# Altium project blackfin.PrjPCB (part 1 of 2)
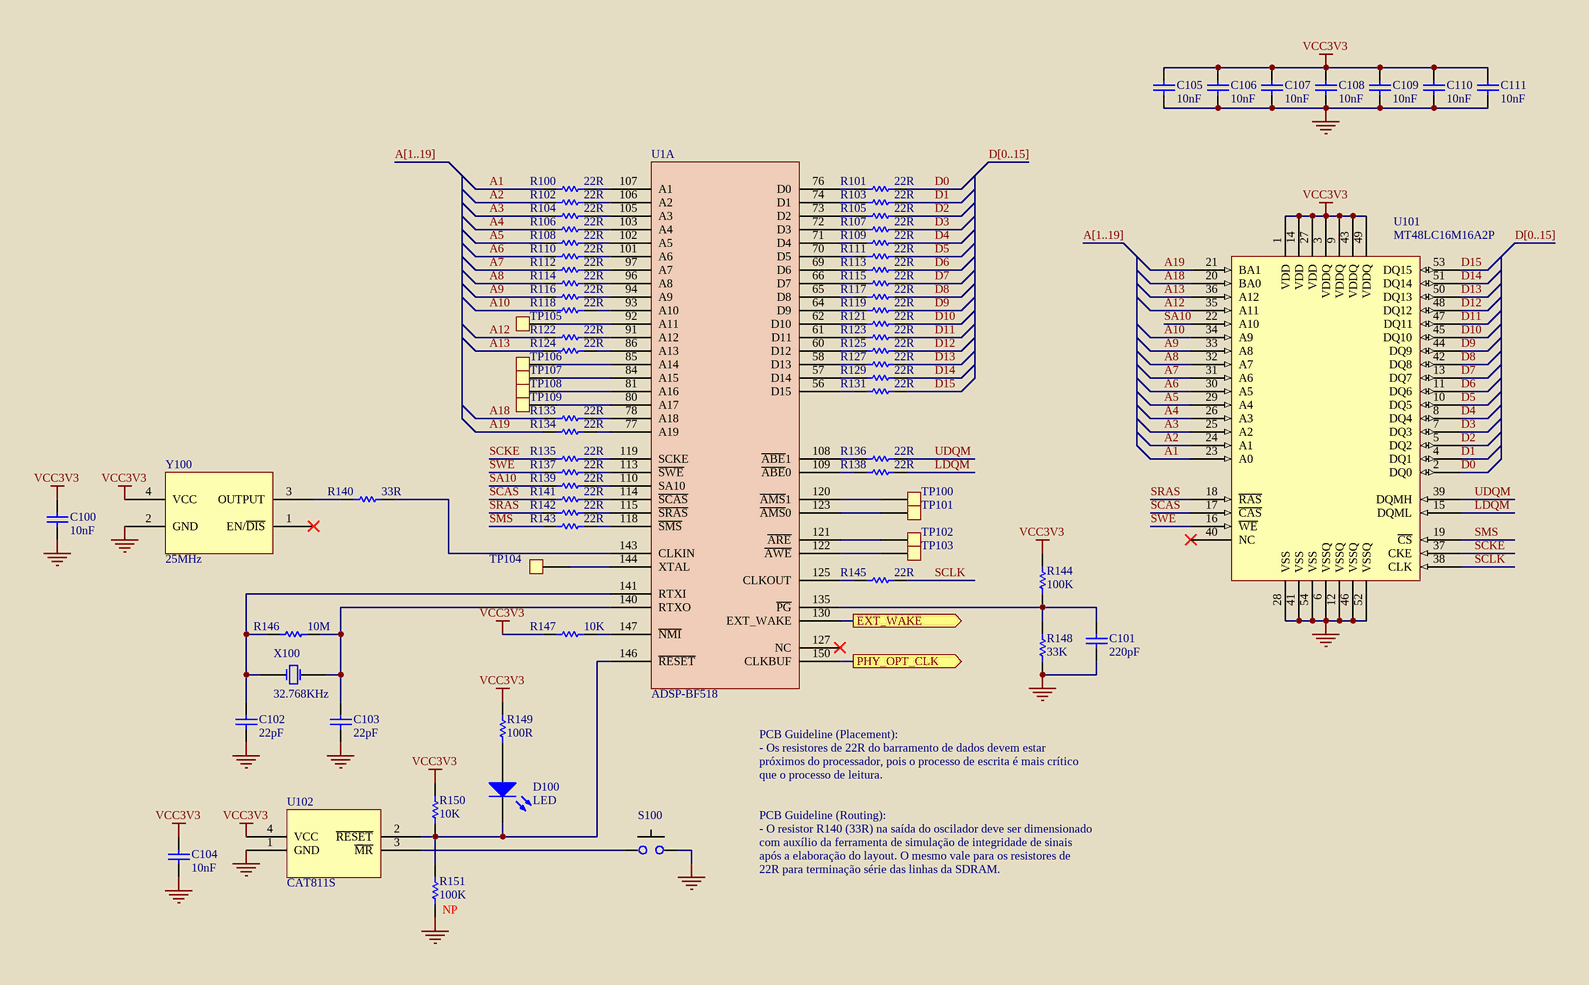
[diagram p0: blackfin_a_sdram.SchDoc]
6 sheets, 408 parts. Net scope: global (net labels, ports and power ports of the same name join across sheets).
Board file: blackfin_pcb.PcbDoc
Sheets:
  blackfin_a_sdram.SchDoc
  blackfin_b_flash_jtag_serial.SchDoc
  blackfin_c_ethernet.SchDoc
  blackfin_d_codec.SchDoc
  blackfin_e_lcd_keypad.SchDoc
  blackfin_f_power.SchDoc

## Sheet blackfin_a_sdram.SchDoc: SDRAM
size A3; SheetNumber: 1; SheetTotal: 6

### Parts
C100  10nF  [C_0603]
C101  220pF  [C_0603]
C102  22pF  [C_0603]
C103  22pF  [C_0603]
C104  10nF  [C_0603]
C105  10nF  [C_0603]
C106  10nF  [C_0603]
C107  10nF  [C_0603]
C108  10nF  [C_0603]
C109  10nF  [C_0603]
C110  10nF  [C_0603]
C111  10nF  [C_0603]
D100  LED  [LED_0603]
R100  22R  [R_0402]
R101  22R  [R_0402]
R102  22R  [R_0402]
R103  22R  [R_0402]
R104  22R  [R_0402]
R105  22R  [R_0402]
R106  22R  [R_0402]
R107  22R  [R_0402]
R108  22R  [R_0402]
R109  22R  [R_0402]
R110  22R  [R_0402]
R111  22R  [R_0402]
R112  22R  [R_0402]
R113  22R  [R_0402]
R114  22R  [R_0402]
R115  22R  [R_0402]
R116  22R  [R_0402]
R117  22R  [R_0402]
R118  22R  [R_0402]
R119  22R  [R_0402]
R121  22R  [R_0402]
R122  22R  [R_0402]
R123  22R  [R_0402]
R124  22R  [R_0402]
R125  22R  [R_0402]
R127  22R  [R_0402]
R129  22R  [R_0402]
R131  22R  [R_0402]
R133  22R  [R_0402]
R134  22R  [R_0402]
R135  22R  [R_0402]
R136  22R  [R_0402]
R137  22R  [R_0402]
R138  22R  [R_0402]
R139  22R  [R_0402]
R140  33R  [R_0402]
R141  22R  [R_0402]
R142  22R  [R_0402]
R143  22R  [R_0402]
R144  100K  [R_0603]
R145  22R  [R_0402]
R146  10M  [R_0603]
R147  10K  [R_0603]
R148  33K  [R_0603]
R149  100R  [R_0603]
R150  10K  [R_0603]
R151  100K  [R_0603]
S100  Push Button  [Push Button]  (value not drawn)
TP100  Test Point  [Test Point]  (value not drawn)  (no BOM)
TP101  Test Point  [Test Point]  (value not drawn)  (no BOM)
TP102  Test Point  [Test Point]  (value not drawn)  (no BOM)
TP103  Test Point  [Test Point]  (value not drawn)  (no BOM)
TP104  Test Point  [Test Point]  (value not drawn)  (no BOM)
TP105  Test Point  [Test Point]  (value not drawn)  (no BOM)
TP106  Test Point  [Test Point]  (value not drawn)  (no BOM)
TP107  Test Point  [Test Point]  (value not drawn)  (no BOM)
TP108  Test Point  [Test Point]  (value not drawn)  (no BOM)
TP109  Test Point  [Test Point]  (value not drawn)  (no BOM)
U1  ADSP-BF518  [LQFP-176]  (part A of 4)
U101  MT48LC16M16A2P  [TSOP-54]
U102  CAT811S  [SOT-143]
X100  32.768KHz  [XTAL_32.768kHz]
Y100  25MHz  [OSC_25MHz]

### Ports
EXT_WAKE (out), PHY_OPT_CLK (out)

### Nets
GND: C100.1 C101.1 C102.1 C103.1 C104.1 C105.1 C106.1 C107.1 C108.1 C109.1 C110.1 C111.1 R148.1 R151.1 S100.2 U101.6(VSSQ) U101.12(VSSQ) U101.28(VSS) U101.41(VSS) U101.46(VSSQ) U101.52(VSSQ) U101.54(VSS) U102.1(GND) Y100.2(GND)
VCC3V3: C100.2 C104.2 C105.2 C106.2 C107.2 C108.2 C109.2 C110.2 C111.2 R144.2 R147.2 R149.2 R150.1 U101.1(VDD) U101.3(VDDQ) U101.9(VDDQ) U101.14(VDD) U101.27(VDD) U101.43(VDDQ) U101.49(VDDQ) U102.4(VCC) Y100.4(VCC)
A1: R100.1 U101.23(A0)
A2: R102.1 U101.24(A1)
A3: R104.1 U101.25(A2)
A4: R106.1 U101.26(A3)
A5: R108.1 U101.29(A4)
A6: R110.1 U101.30(A5)
A7: R112.1 U101.31(A6)
A8: R114.1 U101.32(A7)
A9: R116.1 U101.33(A8)
A10: R118.1 U101.34(A9)
A12: R122.1 U101.35(A11)
A13: R124.1 U101.36(A12)
A18: R133.1 U101.20(BA0)
A19: R134.1 U101.21(BA1)
D0: R101.2 U101.2(DQ0)
D1: R103.2 U101.4(DQ1)
D2: R105.2 U101.5(DQ2)
D3: R107.2 U101.7(DQ3)
D4: R109.2 U101.8(DQ4)
D5: R111.2 U101.10(DQ5)
D6: R113.2 U101.11(DQ6)
D7: R115.2 U101.13(DQ7)
D8: R117.2 U101.42(DQ8)
D9: R119.2 U101.44(DQ9)
D10: R121.2 U101.45(DQ10)
D11: R123.2 U101.47(DQ11)
D12: R125.2 U101.48(DQ12)
D13: R127.2 U101.50(DQ13)
D14: R129.2 U101.51(DQ14)
D15: R131.2 U101.53(DQ15)
EXT_WAKE: U1.130(EXT_WAKE) ; port EXT_WAKE
LDQM: R138.2 U101.15(DQML)
PHY_OPT_CLK: U1.150(CLKBUF) ; port PHY_OPT_CLK
SA10: R139.1 U101.22(A10)
SCAS: R141.1 U101.17(~{CAS})
SCKE: R135.1 U101.37(CKE)
SCLK: R145.2 U101.38(CLK)
SMS: R143.1 U101.19(~{CS})
SRAS: R142.1 U101.18(~{RAS})
SWE: R137.1 U101.16(~{WE})
UDQM: R136.2 U101.39(DQMH)
NetC101_2: C101.2 R144.1 R148.2 U1.135(~{PG})
NetC102_2: C102.2 R146.1 U1.141(RTXI) X100.1(OSC1)
NetC103_2: C103.2 R146.2 U1.140(RTXO) X100.2(OSC2)
NetD100_1: D100.1(A) R149.1
NetD100_2: D100.2(K) R150.2 R151.2 U1.146(~{RESET}) U102.2(~{RESET})
NetR100_2: R100.2 U1.107(A1)
NetR101_1: R101.1 U1.76(D0)
NetR102_2: R102.2 U1.106(A2)
NetR103_1: R103.1 U1.74(D1)
NetR104_2: R104.2 U1.105(A3)
NetR105_1: R105.1 U1.73(D2)
NetR106_2: R106.2 U1.103(A4)
NetR107_1: R107.1 U1.72(D3)
NetR108_2: R108.2 U1.102(A5)
NetR109_1: R109.1 U1.71(D4)
NetR110_2: R110.2 U1.101(A6)
NetR111_1: R111.1 U1.70(D5)
NetR112_2: R112.2 U1.97(A7)
NetR113_1: R113.1 U1.69(D6)
NetR114_2: R114.2 U1.96(A8)
NetR115_1: R115.1 U1.66(D7)
NetR116_2: R116.2 U1.94(A9)
NetR117_1: R117.1 U1.65(D8)
NetR118_2: R118.2 U1.93(A10)
NetR119_1: R119.1 U1.64(D9)
NetR121_1: R121.1 U1.62(D10)
NetR122_2: R122.2 U1.91(A12)
NetR123_1: R123.1 U1.61(D11)
NetR124_2: R124.2 U1.86(A13)
NetR125_1: R125.1 U1.60(D12)
NetR127_1: R127.1 U1.58(D13)
NetR129_1: R129.1 U1.57(D14)
NetR131_1: R131.1 U1.56(D15)
NetR133_2: R133.2 U1.78(A18)
NetR134_2: R134.2 U1.77(A19)
NetR135_2: R135.2 U1.119(SCKE)
NetR136_1: R136.1 U1.108(~{ABE}1)
NetR137_2: R137.2 U1.113(~{SWE})
NetR138_1: R138.1 U1.109(~{ABE}0)
NetR139_2: R139.2 U1.110(SA10)
NetR140_1: R140.1 Y100.3(OUTPUT)
NetR140_2: R140.2 U1.143(CLKIN)
NetR141_2: R141.2 U1.114(~{SCAS})
NetR142_2: R142.2 U1.115(~{SRAS})
NetR143_2: R143.2 U1.118(~{SMS})
NetR145_1: R145.1 U1.125(CLKOUT)
NetR147_1: R147.1 U1.147(~{NMI})
NetS100_1: S100.1 U102.3(~{MR})
NetTP100_1: TP100.1 U1.120(~{AMS}1)
NetTP101_1: TP101.1 U1.123(~{AMS}0)
NetTP102_1: TP102.1 U1.121(~{ARE})
NetTP103_1: TP103.1 U1.122(~{AWE})
NetTP104_1: TP104.1 U1.144(XTAL)
NetTP105_1: TP105.1 U1.92(A11)
NetTP106_1: TP106.1 U1.85(A14)
NetTP107_1: TP107.1 U1.84(A15)
NetTP108_1: TP108.1 U1.81(A16)
NetTP109_1: TP109.1 U1.80(A17)

Not connected (* = marked no-connect by the designer): U1 127(NC)*; U101 40(NC)*; Y100 1(EN/~{DIS})*

### Buses and harness runs
bus A[1..19]
bus D[0..15]

### Notes on the sheet
- PCB Guideline (Placement):
- - Os resistores de 22R do barramento de dados devem estar
- próximos do processador, pois o processo de escrita é mais crítico
- que o processo de leitura.
- PCB Guideline (Routing):
- - O resistor R140 (33R) na saída do oscilador deve ser dimensionado
- com auxílio da ferramenta de simulação de integridade de sinais
- após a elaboração do layout. O mesmo vale para os resistores de
- 22R para terminação série das linhas da SDRAM.
- (near R151) NP
- Título:
- Universidade Federal do Ceará
- Padrão:
- Autor:
- A3
- Rômulo Mendes
- Data:
- Versão:
- Folha:
- V1
- de
- Centro de Tecnologia
- Dep. de Eng. Elétrica
- Dep. de Eng. de Teleinformática
- Arquivo:
- Fortaleza - Ceará - Brasil

### Library data of the parts
C100 C104-C111 = Capacitor: eVendorPart#: 77-VJ0603Y103KXAPBC; Manufacturer: Vishay/Vitramon; Part#: VJ0603Y103KXAPW1BC; eVendor: Mouser; eVendorPrice: 0,05; MSRP: 0,013; MOQ: 1000
C101 = Capacitor: eVendorPart#: 81-GRM18R72A221KA01D; Manufacturer: Murata; Part#: GRM188R72A221KA01D; eVendor: Mouser; eVendorPrice: 0,05; MSRP: 0,012; MOQ: 1000
C102 C103 = Capacitor: eVendorPart#: 581-06035A220J; Manufacturer: AVX; Part#: 06035A220JAT2A; eVendor: Mouser; eVendorPrice: 0,03; MSRP: 0,018; MOQ: 1000
D100 = LED: Red LED; eVendorPart#: 638-QTLP600C2TR; Manufacturer: Everlight; Part#: QTLP600C2TR; eVendor: Mouser; eVendorPrice: 0,22; MSRP: 0,083; MOQ: 1000
R100-R119 R121-R125 R127 R129 R131 R133-R139 R141-R143 R145 = Resistor: eVendorPart#: 71-CRCW0402J-22-E3; Part#: CRCW040222R0JNED; Manufacturer: Vishay/Dale; eVendor: Mouser; eVendorPrice: 0,06; MSRP: 0,01; MOQ: 1000
R140 = Resistor: eVendorPart#: 71-CRCW0402J-33-E3; Part#: CRCW040233R0JNED; Manufacturer: Vishay/Dale; eVendor: Mouser; eVendorPrice: 0,06; MSRP: 0,01; MOQ: 1000
R144 R151 = Resistor: eVendorPart#: 71-CRCW0603J-100K-E3; Part#: CRCW0603100KJNEA; Manufacturer: Vishay/Dale; eVendor: Mouser; eVendorPrice: 0,06; MSRP: 0,01; MOQ: 1000
R146 = Resistor: eVendorPart#: 652-CR0603FX-1005ELF; Part#: CR0603-FX-1005ELF; Manufacturer: Bourns; eVendor: Mouser; eVendorPrice: 0,05; MSRP: 0,004; MOQ: 1000
R147 R150 = Resistor: eVendorPart#: 71-CRCW0603-10K-E3; Part#: CRCW060310K0FKEA; Manufacturer: Vishay/Dale; eVendor: Mouser; eVendorPrice: 0,06; MSRP: 0,015; MOQ: 1000
R148 = Resistor: eVendorPart#: 71-CRCW0603J-33K-E3; Part#: CRCW060333K0JNEA; Manufacturer: Vishay/Dale; eVendor: Mouser; eVendorPrice: 0,06; MSRP: 0,01; MOQ: 1000
R149 = Resistor: eVendorPart#: 71-CRCW0603-100-E3; Part#: CRCW0603100RFKEA; Manufacturer: Vishay/Dale; eVendor: Mouser; eVendorPrice: 0,06; MSRP: 0,015; MOQ: 1000
S100 = Push Button: eVendorPart#: 611-PTS645SH50SMTRLF; Part#: PTS645SH50SMTRLFS; Manufacturer: C&K Components; eVendor: Mouser; MSRP: 0,135; eVendorPrice: 0,27; MOQ: 1000
TP100-TP109 = Test Point: eVendor: NÃO SE APLICA; eVendorPrice: 0,00; eVendorPart#: NÃO SE APLICA; Part#: NÃO SE APLICA; Manufacturer: NÃO SE APLICA; MOQ: 1000; MSRP: 0,00
U1 = ADSP-BF518: eVendorPart#: ADSP-BF518BSWZ-4; eVendor: Analog Devices; eVendorPrice: 13,76; MSRP: 13,07; Part#: ADSP-BF518BSWZ-4; Manufacturer: Analog Devices; MOQ: 1000
U101 = MT48LC16M16A2P: Part#: MT48LC16M16A2P-75:D TR; eVendorPart#: 557-1059-1-ND; Manufacturer: Micron; eVendor: Digikey; eVendorPrice: 10,73; MSRP: 6,6825; MOQ: 1000
U102 = CAT811S: Part#: CAT811STBI-GT3; Manufacturer: ON Semiconductor; eVendorPart#: 698-CAT811STBI-GT3; eVendor: Mouser; eVendorPrice: 0,22; MSRP: 0,156; MOQ: 1000
X100 = XTAL: eVendorPart#: SER2405CT-ND; Part#: MC-405; Manufacturer: Epson; eVendor: Digikey; eVendorPrice: 0,95; MSRP: 0,54; MOQ: 1000
Y100 = Oscillator_25MHz: eVendorPart#: 815-ASV-25-EJ-T; Part#: ASV-25.000MHZ-EJ-T; Manufacturer: ABRACON; eVendor: Mouser; eVendorPrice: 2,89; MSRP: 1,12; MOQ: 1000

## Sheet blackfin_b_flash_jtag_serial.SchDoc: Flash, JTAG, RS-232
size A3; SheetNumber: 2; SheetTotal: 6
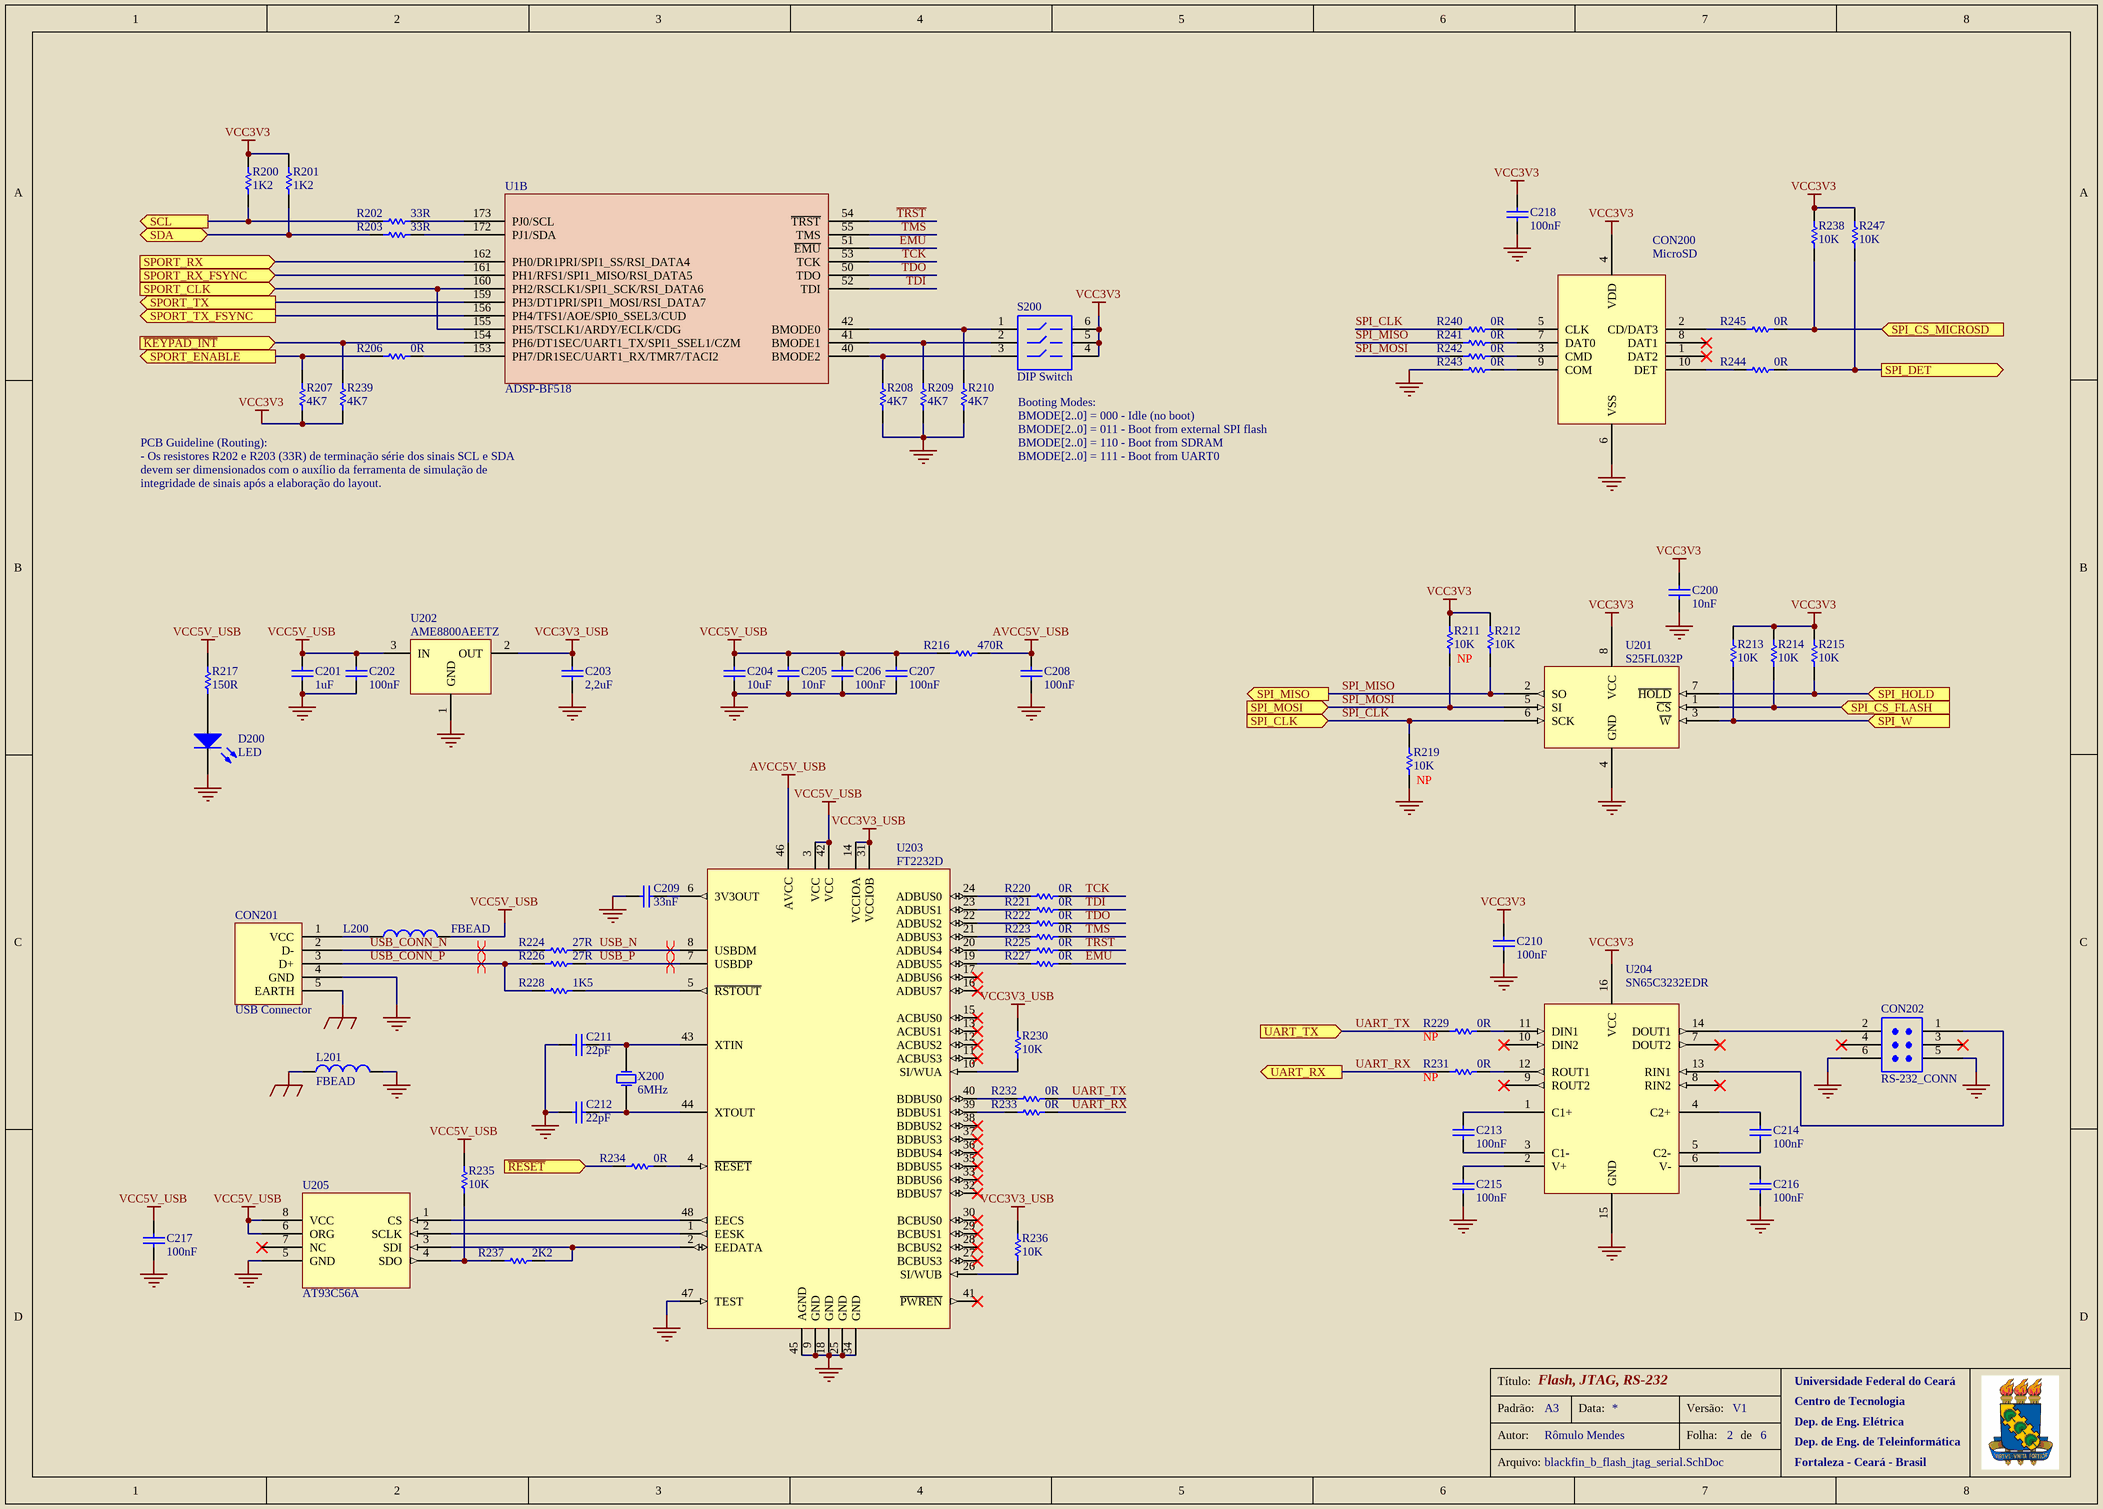
[diagram p1: blackfin_b_flash_jtag_serial.SchDoc]

### Parts
C200  10nF  [C_0603]
C201  1uF  [C_0603]
C202  100nF  [C_0603]
C203  2,2uF  [C_0603]
C204  10uF  [C_0805]
C205  10nF  [C_0603]
C206  100nF  [C_0603]
C207  100nF  [C_0603]
C208  100nF  [C_0603]
C209  33nF  [C_0603]
C210  100nF  [C_0603]
C211  22pF  [C_0603]
C212  22pF  [C_0603]
C213  100nF  [C_0603]
C214  100nF  [C_0603]
C215  100nF  [C_0603]
C216  100nF  [C_0603]
C217  100nF  [C_0603]
C218  100nF  [C_0603]
CON200  MicroSD  [MICRO_SD]
CON201  USB Connector  [USB Connector]
CON202  RS-232_CONN  [Header_2x3]
D200  LED  [LED_0603]
L200  FBEAD  [L_0603]
L201  FBEAD  [L_0603]
R200  1K2  [R_0603]
R201  1K2  [R_0603]
R202  33R  [R_0402]
R203  33R  [R_0402]
R206  0R  [R_0603]
R207  4K7  [R_0603]
R208  4K7  [R_0603]
R209  4K7  [R_0603]
R210  4K7  [R_0603]
R211  10K  [R_0603]
R212  10K  [R_0603]
R213  10K  [R_0603]
R214  10K  [R_0603]
R215  10K  [R_0603]
R216  470R  [R_0603]
R217  150R  [R_0603]
R219  10K  [R_0603]
R220  0R  [R_0603]
R221  0R  [R_0603]
R222  0R  [R_0603]
R223  0R  [R_0603]
R224  27R  [R_0603]
R225  0R  [R_0603]
R226  27R  [R_0603]
R227  0R  [R_0603]
R228  1K5  [R_0603]
R229  0R  [R_0603]
R230  10K  [R_0603]
R231  0R  [R_0603]
R232  0R  [R_0603]
R233  0R  [R_0603]
R234  0R  [R_0603]
R235  10K  [R_0603]
R236  10K  [R_0603]
R237  2K2  [R_0603]
R238  10K  [R_0603]
R239  4K7  [R_0603]
R240  0R  [R_0603]
R241  0R  [R_0603]
R242  0R  [R_0603]
R243  0R  [R_0603]
R244  0R  [R_0603]
R245  0R  [R_0603]
R247  10K  [R_0603]
S200  DIP Switch  [DIP Switch]
U1  ADSP-BF518  [LQFP-176]  (part B of 4)
U201  S25FL032P  [SO-8]
U202  AME8800AEETZ  [SOT-23]
U203  FT2232D  [LQFP-48]
U204  SN65C3232EDR  [SOIC-16]
U205  AT93C56A  [SOIC-8 (AT93C56A)]
X200  6MHz  [XTAL_6MHz]

### Ports
SCL (out), SDA (bidir), SPI_CLK (in), SPI_CS_FLASH (in), SPI_CS_MICROSD (in), SPI_DET (out), SPI_HOLD (in), SPI_MISO (out), SPI_MOSI (in), SPI_W (in), SPORT_CLK (in), SPORT_ENABLE (out), SPORT_RX (in), SPORT_RX_FSYNC (in), SPORT_TX (out), SPORT_TX_FSYNC (out), UART_RX (out), UART_TX (in), ~{KEYPAD_INT} (in), ~{RESET} (in)

### Nets
AVCC5V_USB: C208.2 R216.2 U203.46(AVCC)
EARTH_USB: CON201.5(EARTH) L201.1
GND: C200.1 C201.1 C202.1 C203.1 C204.1 C205.1 C206.1 C207.1 C208.1 C209.2 C210.1 C211.2 C212.2 C215.1 C216.1 C217.1 C218.1 CON200.6(VSS) CON201.4(GND) CON202.5(GND) CON202.6(GND) D200.2(K) L201.2 R208.1 R209.1 R210.1 R219.1 R243.1 U201.4(GND) U202.1(GND) U203.9(GND) U203.18(GND) U203.25(GND) U203.34(GND) U203.45(AGND) U203.47(TEST) U204.15(GND) U205.5(GND)
VCC3V3: C200.2 C210.2 C218.2 CON200.4(VDD) R200.2 R201.2 R207.1 R211.2 R212.2 R213.2 R214.2 R215.2 R238.2 R239.1 R247.2 S200.4 S200.5 S200.6 U201.8(VCC) U204.16(VCC)
VCC3V3_USB: C203.2 R230.1 R236.1 U202.2(OUT) U203.14(VCCIOA) U203.31(VCCIOB)
VCC5V_USB: C201.2 C202.2 C204.2 C205.2 C206.2 C207.2 C217.2 L200.2 R216.1 R217.2 R235.2 U202.3(IN) U203.3(VCC) U203.42(VCC) U205.6(ORG) U205.8(VCC)
~{EMU}: R227.2 U1.51(~{EMU})
~{KEYPAD_INT}: R239.2 U1.154(PH6/DT1SEC/UART1_TX/SPI1_SSEL1/CZM) ; port ~{KEYPAD_INT}
~{RESET}: R234.1 ; port ~{RESET}
SCL: R200.1 R202.1 ; port SCL
SDA: R201.1 R203.1 ; port SDA
SPI_CLK: R219.2 R240.1 U201.6(SCK) ; port SPI_CLK
SPI_CS_FLASH: R214.1 U201.1(~{CS}) ; port SPI_CS_FLASH
SPI_CS_MICROSD: R238.1 R245.2 ; port SPI_CS_MICROSD
SPI_DET: R244.2 R247.1 ; port SPI_DET
SPI_HOLD: R215.1 U201.7(~{HOLD}) ; port SPI_HOLD
SPI_MISO: R212.1 R241.1 U201.2(SO) ; port SPI_MISO
SPI_MOSI: R211.1 R242.1 U201.5(SI) ; port SPI_MOSI
SPI_W: R213.1 U201.3(~{W}) ; port SPI_W
SPORT_CLK: U1.155(PH5/TSCLK1/ARDY/ECLK/CDG) U1.160(PH2/RSCLK1/SPI1_SCK/RSI_DATA6) ; port SPORT_CLK
SPORT_ENABLE: R206.1 R207.2 ; port SPORT_ENABLE
SPORT_RX: U1.162(PH0/DR1PRI/SPI1_SS/RSI_DATA4) ; port SPORT_RX
SPORT_RX_FSYNC: U1.161(PH1/RFS1/SPI1_MISO/RSI_DATA5) ; port SPORT_RX_FSYNC
SPORT_TX: U1.159(PH3/DT1PRI/SPI1_MOSI/RSI_DATA7) ; port SPORT_TX
SPORT_TX_FSYNC: U1.156(PH4/TFS1/AOE/SPI0_SSEL3/CUD) ; port SPORT_TX_FSYNC
~{TRST}: R225.2 U1.54(~{TRST})
TCK: R220.2 U1.53(TCK)
TDI: R221.2 U1.52(TDI)
TDO: R222.2 U1.50(TDO)
TMS: R223.2 U1.55(TMS)
UART_RX: R231.1 R233.2 ; port UART_RX
UART_TX: R229.1 R232.2 ; port UART_TX
USB_CONN_N: CON201.2(D-) R224.1
USB_CONN_P: CON201.3(D+) R226.1 R228.1
USB_N: R224.2 U203.8(USBDM)
USB_P: R226.2 U203.7(USBDP)
NetC209_1: C209.1 U203.6(3V3OUT)
NetC211_1: C211.1 U203.43(XTIN) X200.2(OSC2)
NetC212_1: C212.1 U203.44(XTOUT) X200.1(OSC1)
NetC213_1: C213.1 U204.3(C1-)
NetC213_2: C213.2 U204.1(C1+)
NetC214_1: C214.1 U204.5(C2-)
NetC214_2: C214.2 U204.4(C2+)
NetC215_2: C215.2 U204.2(V+)
NetC216_2: C216.2 U204.6(V-)
NetCON200_2: CON200.2(CD/DAT3) R245.1
NetCON200_3: CON200.3(CMD) R242.2
NetCON200_5: CON200.5(CLK) R240.2
NetCON200_7: CON200.7(DAT0) R241.2
NetCON200_9: CON200.9(COM) R243.2
NetCON200_10: CON200.10(DET) R244.1
NetCON201_1: CON201.1(VCC) L200.1
NetCON202_1: CON202.1(TX) U204.13(RIN1)
NetCON202_2: CON202.2(RX) U204.14(DOUT1)
NetD200_1: D200.1(A) R217.1
NetR202_2: R202.2 U1.173(PJ0/SCL)
NetR203_2: R203.2 U1.172(PJ1/SDA)
NetR206_2: R206.2 U1.153(PH7/DR1SEC/UART1_RX/TMR7/TACI2)
NetR208_2: R208.2 S200.3 U1.40(BMODE2)
NetR209_2: R209.2 S200.2 U1.41(BMODE1)
NetR210_2: R210.2 S200.1 U1.42(BMODE0)
NetR220_1: R220.1 U203.24(ADBUS0)
NetR221_1: R221.1 U203.23(ADBUS1)
NetR222_1: R222.1 U203.22(ADBUS2)
NetR223_1: R223.1 U203.21(ADBUS3)
NetR225_1: R225.1 U203.20(ADBUS4)
NetR227_1: R227.1 U203.19(ADBUS5)
NetR228_2: R228.2 U203.5(~{RSTOUT})
NetR229_2: R229.2 U204.11(DIN1)
NetR230_2: R230.2 U203.10(SI/WUA)
NetR231_2: R231.2 U204.12(ROUT1)
NetR232_1: R232.1 U203.40(BDBUS0)
NetR233_1: R233.1 U203.39(BDBUS1)
NetR234_2: R234.2 U203.4(~{RESET})
NetR235_1: R235.1 R237.2 U205.4(SDO)
NetR236_2: R236.2 U203.26(SI/WUB)
NetR237_1: R237.1 U203.2(EEDATA) U205.3(SDI)
NetU203_1: U203.1(EESK) U205.2(SCLK)
NetU203_48: U203.48(EECS) U205.1(CS)

Not connected (* = marked no-connect by the designer): CON200 1(DAT2)* 8(DAT1)*; CON202 3(NC)* 4(NC)*; U203 11(ACBUS3)* 12(ACBUS2)* 13(ACBUS1)* 15(ACBUS0)* 16(ADBUS7)* 17(ADBUS6)* 27(BCBUS3)* 28(BCBUS2)* 29(BCBUS1)* 30(BCBUS0)* 32(BDBUS7)* 33(BDBUS6)* 35(BDBUS5)* 36(BDBUS4)* 37(BDBUS3)* 38(BDBUS2)* 41(~{PWREN})*; U204 7(DOUT2)* 8(RIN2)* 9(ROUT2)* 10(DIN2)*; U205 7(NC)*

### Layout directives
differential pair: USB_CONN_N, USB_CONN_P, USB_N, USB_P

### Notes on the sheet
- (near R207) PCB Guideline (Routing):
- Booting Modes:
- BMODE[2..0] = 000 - Idle (no boot)
- BMODE[2..0] = 011 - Boot from external SPI flash
- BMODE[2..0] = 110 - Boot from SDRAM
- - Os resistores R202 e R203 (33R) de terminação série dos sinais SCL e SDA
- devem ser dimensionados com o auxílio da ferramenta de simulação de
- integridade de sinais após a elaboração do layout.
- BMODE[2..0] = 111 - Boot from UART0
- (near R211) NP
- (near R219) NP
- (near R229) NP
- (near R231) NP
- Título:
- Universidade Federal do Ceará
- Padrão:
- Autor:
- A3
- Rômulo Mendes
- Data:
- Versão:
- Folha:
- V1
- de
- Centro de Tecnologia
- Dep. de Eng. Elétrica
- Dep. de Eng. de Teleinformática
- Arquivo:
- Fortaleza - Ceará - Brasil

### Library data of the parts
C200 C205 = Capacitor: as C100 on sheet blackfin_a_sdram; MOQ: 1000
C201 = Capacitor: eVendorPart#: 81-GRM188F51E105ZA12; Manufacturer: Murata; Part#: GRM188F51E105ZA12D; eVendor: Mouser; eVendorPrice: 0,07; MSRP: 0,016; MOQ: 1000
C202 C206-C208 C210 C213-C218 = Capacitor: eVendorPart#: 81-GRM188R71E104KA01; Manufacturer: Murata; Part#: GRM188R71E104KA01J; eVendor: Mouser; eVendorPrice: 0,14; MSRP: 0,11; MOQ: 1000
C203 = Capacitor: eVendorPart#: 81-GRM188F51A225ZE01; Manufacturer: Murata; Part#: GRM188F51A225ZE01D; eVendor: Mouser; eVendorPrice: 0,11; MSRP: 0,024; MOQ: 1000
C204 = Capacitor: eVendorPart#: 810-C2012Y5V1C106Z; Manufacturer: TDK; Part#: C2012Y5V1C106Z; eVendor: Mouser; eVendorPrice: 0,10; MSRP: 0,05; MOQ: 1000
C209 = Capacitor: eVendorPart#: 81-GRM18B11E333KA01D; Manufacturer: Murata; Part#: GRM188B11E333KA01D; eVendor: Mouser; eVendorPrice: 0,07; MSRP: 0,013; MOQ: 1000
C211 C212 = Capacitor: as C102 on sheet blackfin_a_sdram; MOQ: 1000
CON200 = MicroSD: Manufacturer: AVX Corporation; Part#: 045138008010890+; eVendorPart#: 478-4965-1-ND; MSRP: 2,394; eVendorPrice: 3,86; eVendor: Digikey; MOQ: 1000
CON201 = USB Connector: eVendorPart#: 649-61729-0010BLF; Manufacturer: FCI; Part#: 61729-0010BLF; eVendor: Mouser; eVendorPrice: 0,58; MSRP: 0,39; MOQ: 1000
CON202 = RS-232 Connector: Part#: 87759-0614; eVendorPart#: 538-87759-0614; Manufacturer: Molex; eVendor: Mouser; eVendorPrice: 0,62; MSRP: 0,48; MOQ: 1000
D200 = LED: as D100 on sheet blackfin_a_sdram; MOQ: 1000
L200 L201 = Inductor: eVendorPart#: 875-MI0603L301R-10; Manufacturer: Laird Technologies; Part#: MI0603L301R-10; eVendor: Mouser; eVendorPrice: 0,16; MSRP: 0,066; MOQ: 1000
R200 R201 = Resistor: eVendorPart#: 71-CRCW0603-1.2K-E3; Part#: CRCW06031K20FKEA; Manufacturer: Vishay/Dale; eVendor: Mouser; eVendorPrice: 0,06; MSRP: 0,015; MOQ: 1000
R202 R203 = Resistor: as R140 on sheet blackfin_a_sdram; MOQ: 1000
R206 R220-R223 R225 R227 R229 R231-R234 R240-R245 = Resistor: eVendorPart#: 71-CRCW06030000Z0EB; Part#: CRCW06030000Z0EB; Manufacturer: Vishay/Dale; eVendor: Mouser; eVendorPrice: 0,06; MSRP: 0,015; MOQ: 1000
R207-R210 R239 = Resistor: eVendorPart#: 71-CRCW0603J-4.7K-E3; Part#: CRCW06034K70JNEA; Manufacturer: Vishay/Dale; eVendor: Mouser; eVendorPrice: 0,06; MSRP: 0,01; MOQ: 1000
R211-R215 R219 R230 R235 R236 R238 R247 = Resistor: as R147 on sheet blackfin_a_sdram; MOQ: 1000
R216 = Resistor: eVendorPart#: 71-CRCW0603-470-E3; Part#: CRCW0603470RFKEA; Manufacturer: Vishay/Dale; eVendor: Mouser; eVendorPrice: 0,06; MSRP: 0,015; MOQ: 1000
R217 = Resistor: eVendorPart#: 71-CRCW0603150RJNEB; Part#: CRCW0603150RJNEB; Manufacturer: Vishay/Dale; eVendor: Mouser; eVendorPrice: 0,06; MSRP: 0,01; MOQ: 1000
R224 R226 = Resistor: eVendorPart#: 71-CRCW0603-27-E3; Part#: CRCW060327R0FKEA; Manufacturer: Vishay/Dale; eVendor: Mouser; eVendorPrice: 0,06; MSRP: 0,015; MOQ: 1000
R228 = Resistor: eVendorPart#: 71-CRCW0603-1.5K-E3; Part#: CRCW06031K50FKEA; Manufacturer: Vishay/Dale; eVendor: Mouser; eVendorPrice: 0,06; MSRP: 0,015; MOQ: 1000
R237 = Resistor: eVendorPart#: 71-CRCW06032K20JNEB; Part#: CRCW06032K20JNEB; Manufacturer: Vishay/Dale; eVendor: Mouser; eVendorPrice: 0,06; MSRP: 0,01; MOQ: 1000
S200 = DIP Switch: eVendorPart#: 611-SDA03H1SBD; Manufacturer: C&K Components; Part#: SDA03H1SBD; eVendor: Mouser; eVendorPrice: 1,21; MSRP: 0,73; MOQ: 1000
U1 = ADSP-BF518: as U1 on sheet blackfin_a_sdram; Part#: ADSP-BF518BSWZ-4; Manufacturer: Analog Devices; MOQ: 1000
U201 = S25FL032P: Part#: S25FL032P0XMFI010; Manufacturer: Spansion; eVendor: Avnet; eVendorPrice: 1,63; MSRP: 1,61; eVendorPart#: S25FL032P0XMFI010; MOQ: 1000
U202 = AME8800AEETZ: eVendorPart#: 827-AME8800AEETZ; Manufacturer: AME; eVendor: Mouser; eVendorPrice: 0,67; MSRP: 0,171; MOQ: 1000; Part#: AME8800AEETZ
U203 = FT2232D: eVendorPart#: 895-FT2232D; Manufacturer: FTDI; eVendor: Mouser; MSRP: 3,80; eVendorPrice: 6,99; Part#: FT2232D; MOQ: 1000
U204 = RS-232 Transceiver: eVendorPart#: 595-SN65C3232EDR; Manufacturer: Texas Instruments; eVendor: Mouser; MSRP: 0,932; eVendorPrice: 1,41; Part#: SN65C3232EDR; MOQ: 1000
U205 = AT93C56A: eVendorPart#: 556-A93C56A10SU2.7; Manufacturer: Atmel; Part#: AT93C56A-10SU-2.7; eVendor: Mouser; eVendorPrice: 0,42; MSRP: 0,24; MOQ: 1000
X200 = XTAL: eVendorPart#: 774-ATS060SM-1; Part#: ATS060SM-1; Manufacturer: CTS Electronic Components; eVendor: Mouser; eVendorPrice: 0,49; MSRP: 0,23; MOQ: 1000

## Sheet blackfin_c_ethernet.SchDoc: Ethernet
size A3; SheetNumber: 3; SheetTotal: 6
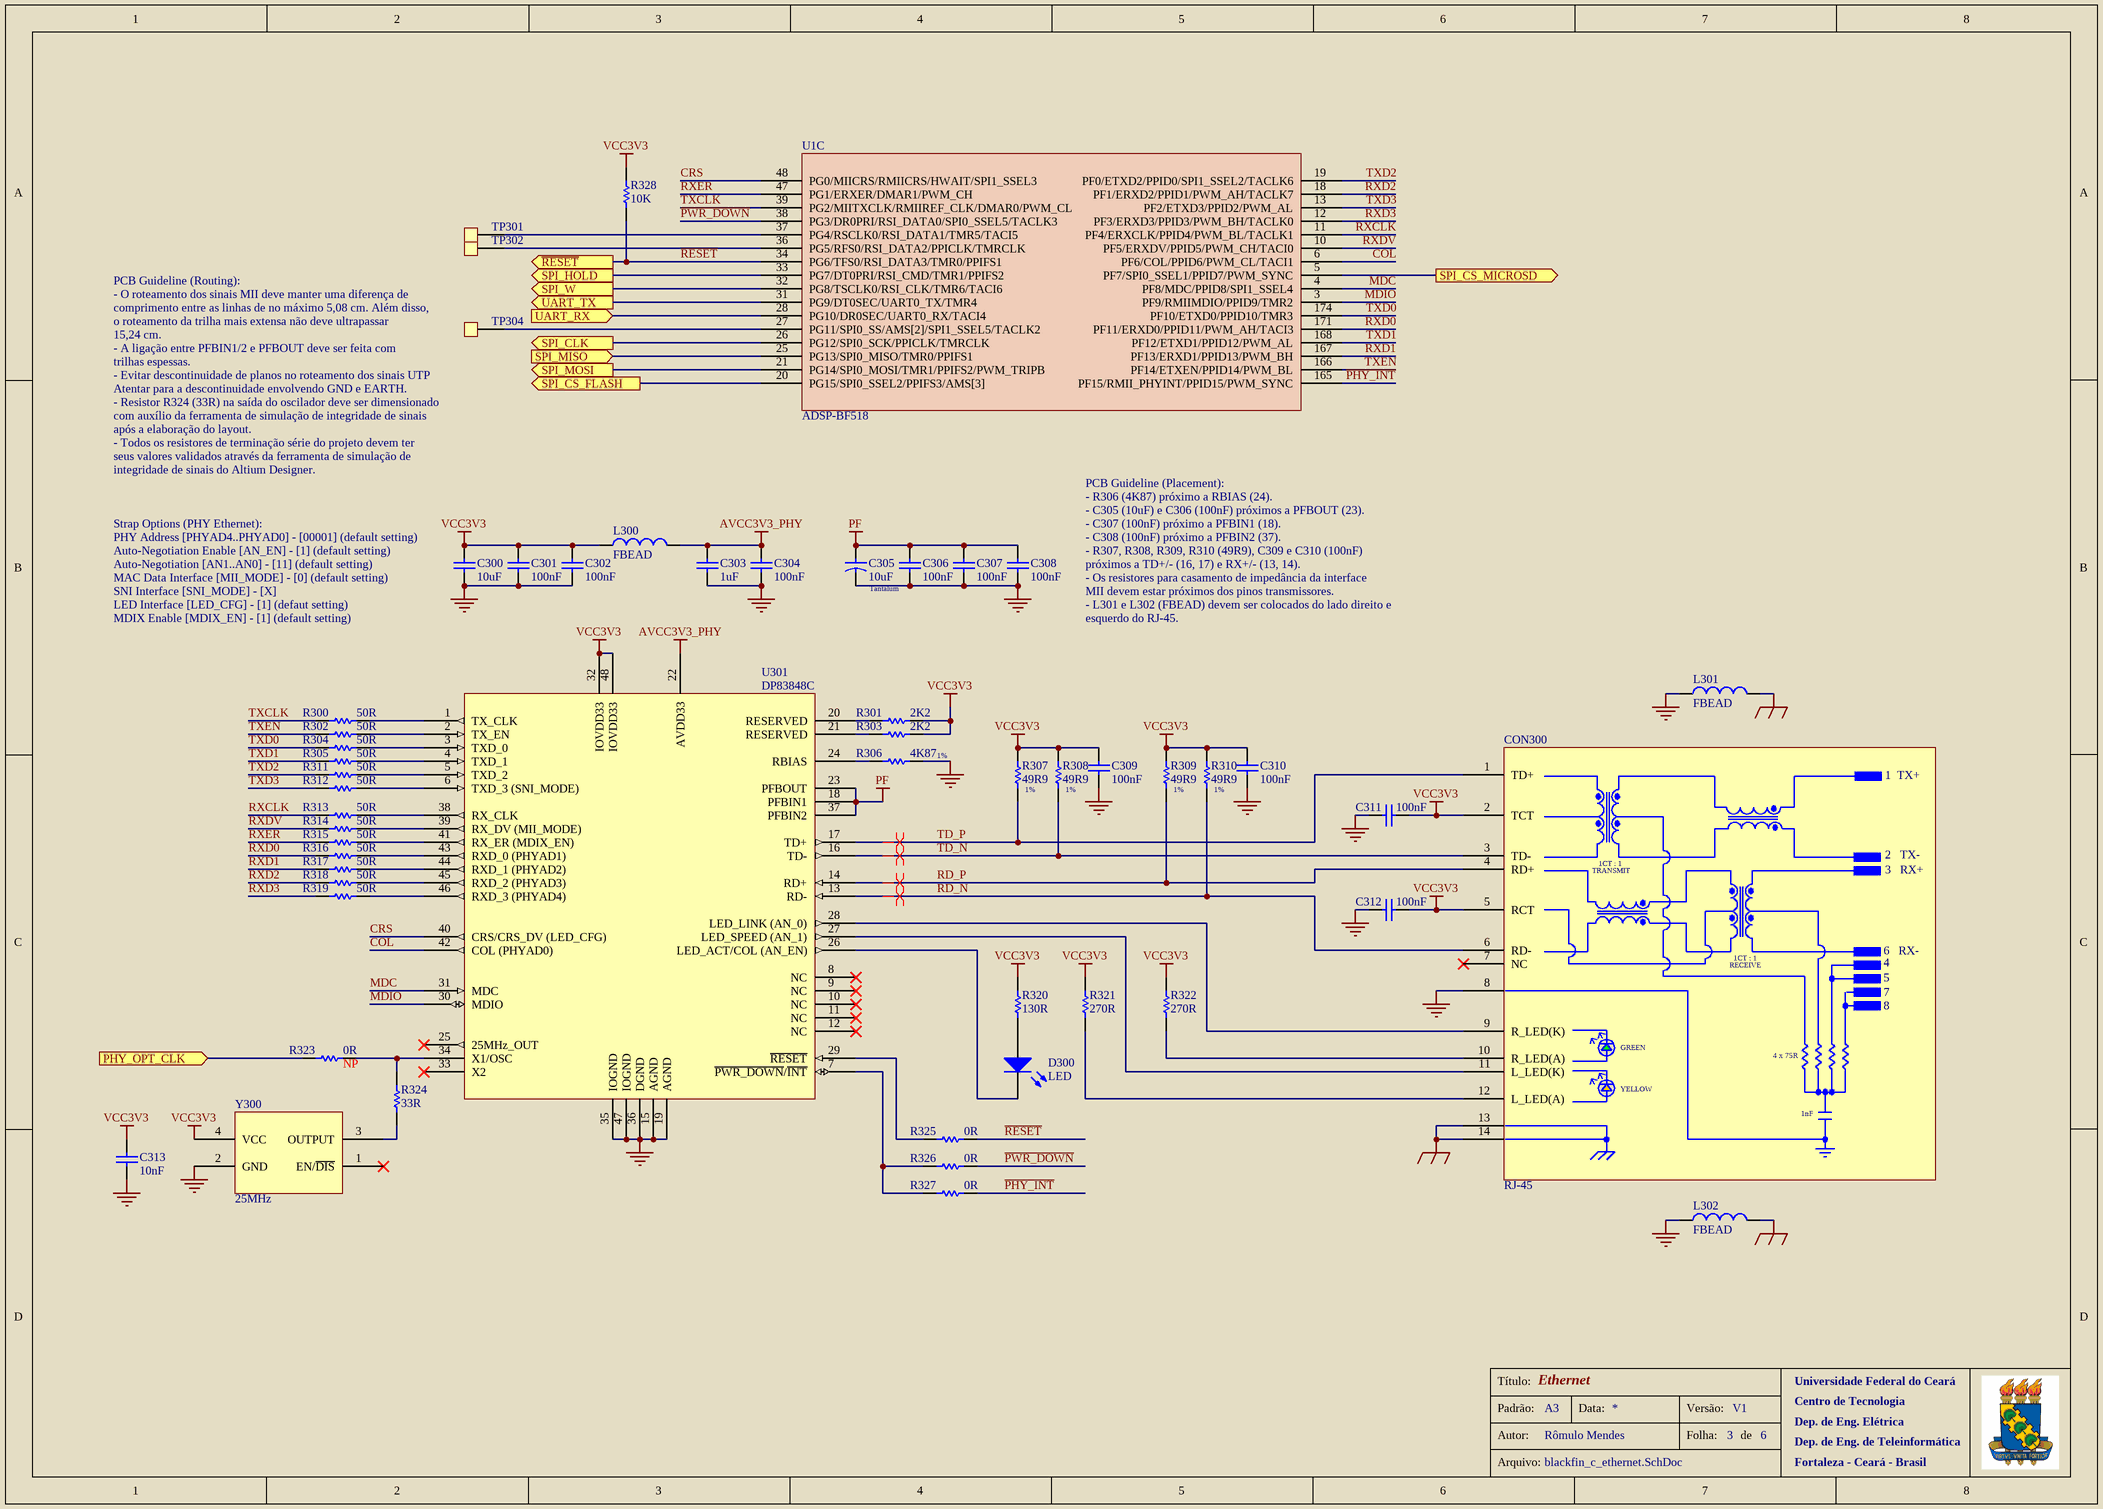
[diagram p2: blackfin_c_ethernet.SchDoc]

### Parts
C300  10uF  [C_0805]
C301  100nF  [C_0603]
C302  100nF  [C_0603]
C303  1uF  [C_0603]
C304  100nF  [C_0603]
C305  10uF  [C_Case_A]
C306  100nF  [C_0603]
C307  100nF  [C_0603]
C308  100nF  [C_0603]
C309  100nF  [C_0603]
C310  100nF  [C_0603]
C311  100nF  [C_0603]
C312  100nF  [C_0603]
C313  10nF  [C_0603]
CON300  RJ-45  [RJ-45]
D300  LED  [LED_0603]
L300  FBEAD  [L_0603]
L301  FBEAD  [L_0603]
L302  FBEAD  [L_0603]
R300  50R  [R_0402]
R301  2K2  [R_0603]
R302  50R  [R_0402]
R303  2K2  [R_0603]
R304  50R  [R_0402]
R305  50R  [R_0402]
R306  4K87  [R_0603]
R307  49R9  [R_0603]
R308  49R9  [R_0603]
R309  49R9  [R_0603]
R310  49R9  [R_0603]
R311  50R  [R_0402]
R312  50R  [R_0402]
R313  50R  [R_0402]
R314  50R  [R_0402]
R315  50R  [R_0402]
R316  50R  [R_0402]
R317  50R  [R_0402]
R318  50R  [R_0402]
R319  50R  [R_0402]
R320  130R  [R_0603]
R321  270R  [R_0603]
R322  270R  [R_0603]
R323  0R  [R_0603]
R324  33R  [R_0402]
R325  0R  [R_0603]
R326  0R  [R_0603]
R327  0R  [R_0603]
R328  10K  [R_0603]
TP301  Test Point  [Test Point]  (value not drawn)  (no BOM)
TP302  Test Point  [Test Point]  (value not drawn)  (no BOM)
TP304  Test Point  [Test Point]  (value not drawn)  (no BOM)
U1  ADSP-BF518  [LQFP-176]  (part C of 4)
U301  DP83848C  [LQFP-48]
Y300  25MHz  [OSC_25MHz]

### Ports
PHY_OPT_CLK (in), SPI_CLK (out), SPI_CS_FLASH (out), SPI_CS_MICROSD (out), SPI_HOLD (out), SPI_MISO (in), SPI_MOSI (out), SPI_W (out), UART_RX (in), UART_TX (out), ~{RESET} (out)

### Nets
AVCC3V3_PHY: C303.2 C304.2 L300.2 U301.22(AVDD33)
EARTH_ETH: CON300.13(GND) CON300.14(GND) L301.2 L302.2
GND: C300.1 C301.1 C302.1 C303.1 C304.1 C305.2 C306.1 C307.1 C308.1 C309.1 C310.1 C311.2 C312.2 C313.1 CON300.8(GND) L301.1 L302.1 R306.1 U301.15(AGND) U301.19(AGND) U301.35(IOGND) U301.36(DGND) U301.47(IOGND) Y300.2(GND)
PF: C305.1 C306.2 C307.2 C308.2 U301.18(PFBIN1) U301.23(PFBOUT) U301.37(PFBIN2)
VCC3V3: C300.2 C301.2 C302.2 C309.2 C310.2 C311.1 C312.1 C313.2 CON300.2(TCT) CON300.5(RCT) L300.1 R301.1 R303.1 R307.2 R308.2 R309.2 R310.2 R320.2 R321.2 R322.2 R328.1 U301.32(IOVDD33) U301.48(IOVDD33) Y300.4(VCC)
COL: U1.6(PF6/COL/PPID6/PWM_CL/TACI1) U301.42(COL_(PHYAD0))
CRS: U1.48(PG0/MIICRS/RMIICRS/HWAIT/SPI1_SSEL3) U301.40(CRS/CRS_DV_(LED_CFG))
MDC: U1.4(PF8/MDC/PPID8/SPI1_SSEL4) U301.31(MDC)
MDIO: U1.3(PF9/RMIIMDIO/PPID9/TMR2) U301.30(MDIO)
~{PHY_INT}: R327.2 U1.165(PF15/RMII_PHYINT/PPID15/PWM_SYNC)
~{PWR_DOWN}: R326.2 U1.38(PG3/DR0PRI/RSI_DATA0/SPI0_SSEL5/TACLK3)
PHY_OPT_CLK: R323.1 ; port PHY_OPT_CLK
~{RESET}: R325.2 R328.2 U1.34(PG6/TFS0/RSI_DATA3/TMR0/PPIFS1) ; port ~{RESET}
RD_N: CON300.6(RD-) R310.1 U301.13(RD-)
RD_P: CON300.4(RD+) R309.1 U301.14(RD+)
RXCLK: R313.1 U1.11(PF4/ERXCLK/PPID4/PWM_BL/TACLK1)
RXD0: R316.1 U1.171(PF11/ERXD0/PPID11/PWM_AH/TACI3)
RXD1: R317.1 U1.167(PF13/ERXD1/PPID13/PWM_BH)
RXD2: R318.1 U1.18(PF1/ERXD2/PPID1/PWM_AH/TACLK7)
RXD3: R319.1 U1.12(PF3/ERXD3/PPID3/PWM_BH/TACLK0)
RXDV: R314.1 U1.10(PF5/ERXDV/PPID5/PWM_CH/TACI0)
RXER: R315.1 U1.47(PG1/ERXER/DMAR1/PWM_CH)
SPI_CLK: U1.26(PG12/SPI0_SCK/PPICLK/TMRCLK) ; port SPI_CLK
SPI_CS_FLASH: U1.20(PG15/SPI0_SSEL2/PPIFS3/AMS[3]) ; port SPI_CS_FLASH
SPI_CS_MICROSD: U1.5(PF7/SPI0_SSEL1/PPID7/PWM_SYNC) ; port SPI_CS_MICROSD
SPI_HOLD: U1.33(PG7/DT0PRI/RSI_CMD/TMR1/PPIFS2) ; port SPI_HOLD
SPI_MISO: U1.25(PG13/SPI0_MISO/TMR0/PPIFS1) ; port SPI_MISO
SPI_MOSI: U1.21(PG14/SPI0_MOSI/TMR1/PPIFS2/PWM_TRIPB) ; port SPI_MOSI
SPI_W: U1.32(PG8/TSCLK0/RSI_CLK/TMR6/TACI6) ; port SPI_W
TD_N: CON300.3(TD-) R308.1 U301.16(TD-)
TD_P: CON300.1(TD+) R307.1 U301.17(TD+)
TXCLK: R300.1 U1.39(PG2/MIITXCLK/RMIIREF_CLK/DMAR0/PWM_CL)
TXD0: R304.1 U1.174(PF10/ETXD0/PPID10/TMR3)
TXD1: R305.1 U1.168(PF12/ETXD1/PPID12/PWM_AL)
TXD2: R311.1 U1.19(PF0/ETXD2/PPID0/SPI1_SSEL2/TACLK6)
TXD3: R312.1 U1.13(PF2/ETXD3/PPID2/PWM_AL)
TXEN: R302.1 U1.166(PF14/ETXEN/PPID14/PWM_BL)
UART_RX: U1.28(PG10/DR0SEC/UART0_RX/TACI4) ; port UART_RX
UART_TX: U1.31(PG9/DT0SEC/UART0_TX/TMR4) ; port UART_TX
NetCON300_9: CON300.9(R_LED(K)) U301.28(LED_LINK_(AN_0))
NetCON300_10: CON300.10(R_LED(A)) R322.1
NetCON300_11: CON300.11(L_LED(K)) U301.27(LED_SPEED_(AN_1))
NetCON300_12: CON300.12(L_LED(A)) R321.1
NetD300_1: D300.1(A) R320.1
NetD300_2: D300.2(K) U301.26(LED_ACT/COL_(AN_EN))
NetR300_2: R300.2 U301.1(TX_CLK)
NetR301_2: R301.2 U301.20(RESERVED)
NetR302_2: R302.2 U301.2(TX_EN)
NetR303_2: R303.2 U301.21(RESERVED)
NetR304_2: R304.2 U301.3(TXD_0)
NetR305_2: R305.2 U301.4(TXD_1)
NetR306_2: R306.2 U301.24(RBIAS)
NetR311_2: R311.2 U301.5(TXD_2)
NetR312_2: R312.2 U301.6(TXD_3_(SNI_MODE))
NetR313_2: R313.2 U301.38(RX_CLK)
NetR314_2: R314.2 U301.39(RX_DV_(MII_MODE))
NetR315_2: R315.2 U301.41(RX_ER_(MDIX_EN))
NetR316_2: R316.2 U301.43(RXD_0_(PHYAD1))
NetR317_2: R317.2 U301.44(RXD_1_(PHYAD2))
NetR318_2: R318.2 U301.45(RXD_2_(PHYAD3))
NetR319_2: R319.2 U301.46(RXD_3_(PHYAD4))
NetR323_2: R323.2 R324.2 U301.34(X1/OSC)
NetR324_1: R324.1 Y300.3(OUTPUT)
NetR325_1: R325.1 U301.29(~{RESET})
NetR326_1: R326.1 R327.1 U301.7(~{PWR_DOWN}/~{INT})
NetTP301_1: TP301.1 U1.37(PG4/RSCLK0/RSI_DATA1/TMR5/TACI5)
NetTP302_1: TP302.1 U1.36(PG5/RFS0/RSI_DATA2/PPICLK/TMRCLK)
NetTP304_1: TP304.1 U1.27(PG11/SPI0_SS/AMS[2]/SPI1_SSEL5/TACLK2)

Not connected (* = marked no-connect by the designer): CON300 7(NC)*; U301 8(NC)* 9(NC)* 10(NC)* 11(NC)* 12(NC)* 25(25MHz_OUT)* 33(X2)*; Y300 1(EN/~{DIS})*

### Layout directives
differential pair: RD_N, RD_P, TD_N, TD_P

### Notes on the sheet
- PCB Guideline (Routing):
- - O roteamento dos sinais MII deve manter uma diferença de
- (near TP304) comprimento entre as linhas de no máximo 5,08 cm. Além disso,
- (near TP304) - A ligação entre PFBIN1/2 e PFBOUT deve ser feita com
- trilhas espessas.
- (near TP304) - Evitar descontinuidade de planos no roteamento dos sinais UTP
- (near TP304) o roteamento da trilha mais extensa não deve ultrapassar
- 15,24 cm.
- Atentar para a descontinuidade envolvendo GND e EARTH.
- - Resistor R324 (33R) na saída do oscilador deve ser dimensionado
- com auxílio da ferramenta de simulação de integridade de sinais
- após a elaboração do layout.
- - Todos os resistores de terminação série do projeto devem ter
- seus valores validados através da ferramenta de simulação de
- integridade de sinais do Altium Designer.
- PCB Guideline (Placement):
- - R306 (4K87) próximo a RBIAS (24).
- - C305 (10uF) e C306 (100nF) próximos a PFBOUT (23).
- Strap Options (PHY Ethernet):
- (near C300) PHY Address [PHYAD4..PHYAD0] - [00001] (default setting)
- (near C300) MAC Data Interface [MII_MODE] - [0] (default setting)
- (near C300) Auto-Negotiation Enable [AN_EN] - [1] (default setting)
- (near C300) Auto-Negotiation [AN1..AN0] - [11] (default setting)
- - C307 (100nF) próximo a PFBIN1 (18).
- - C308 (100nF) próximo a PFBIN2 (37).
- - R307, R308, R309, R310 (49R9), C309 e C310 (100nF)
- próximos a TD+/- (16, 17) e RX+/- (13, 14).
- - Os resistores para casamento de impedância da interface
- SNI Interface [SNI_MODE] - [X]
- LED Interface [LED_CFG] - [1] (defaut setting)
- MDIX Enable [MDIX_EN] - [1] (default setting)
- Tantalum
- - L301 e L302 (FBEAD) devem ser colocados do lado direito e
- esquerdo do RJ-45.
- MII devem estar próximos dos pinos transmissores.
- 1%
- (near R307) 1%
- (near R308) 1%
- (near R309) 1%
- (near R310) 1%
- (near R323) NP
- Título:
- Universidade Federal do Ceará
- Padrão:
- Autor:
- A3
- Rômulo Mendes
- Data:
- Versão:
- Folha:
- V1
- de
- Centro de Tecnologia
- Dep. de Eng. Elétrica
- Dep. de Eng. de Teleinformática
- Arquivo:
- Fortaleza - Ceará - Brasil
- (in symbol RJ-45) 1  TX+; 2   TX-; 1CT : 1; TRANSMIT; 3   RX+; 6   RX-; RECEIVE; GREEN; 4 x 75R; YELLOW; 1nF

### Library data of the parts
C300 = Capacitor: as C204 on sheet blackfin_b_flash_jtag_serial; MOQ: 1000
C301 C302 C304 C306-C312 = Capacitor: as C202 on sheet blackfin_b_flash_jtag_serial; MOQ: 1000
C303 = Capacitor: as C201 on sheet blackfin_b_flash_jtag_serial; MOQ: 1000
C305 = Capacitor_Pol: eVendorPart#: 80-B45196H3106K109; Part#: B45196H3106K109V17; Manufacturer: Kemet; eVendor: Mouser; eVendorPrice: 0,13; MSRP: 0,06; MOQ: 1000
C313 = Capacitor: as C100 on sheet blackfin_a_sdram; MOQ: 1000
CON300 = RJ-45: eVendorPart#: 673-J1012F01C; Part#: J1012F01C; Manufacturer: Pulse; eVendor: Mouser; eVendorPrice: 7,86; MSRP: 3,86; MOQ: 1000
D300 = LED: Green LED; eVendorPart#: 638-QTLP600C4; Manufacturer: Everlight; Part#: QTLP600C4TR; eVendor: Mouser; eVendorPrice: 0,02; MSRP: 0,075; MOQ: 1000
L300-L302 = Inductor: as L200 on sheet blackfin_b_flash_jtag_serial; MOQ: 1000
R300 R302 R304 R305 R311-R319 = Resistor: eVendorPart#: 71-CRCW0402-49.9-E3; Part#: CRCW040249R9FKED; Manufacturer: Vishay/Dale; eVendor: Mouser; eVendorPrice: 0,07; MSRP: 0,015; MOQ: 1000
R301 R303 = Resistor: as R237 on sheet blackfin_b_flash_jtag_serial; MOQ: 1000
R306 = Resistor: eVendorPart#: 71-CRCW0603-4.87K-E3; Part#: CRCW06034K87FKEA; Manufacturer: Vishay/Dale; eVendor: Mouser; eVendorPrice: 0,06; MSRP: 0,015; MOQ: 1000
R307-R310 = Resistor: eVendorPart#: 71-CRCW060349R9FKEB; Part#: CRCW060349R9FKEB; Manufacturer: Vishay/Dale; eVendor: Mouser; eVendorPrice: 0,06; MSRP: 0,015; MOQ: 1000
R320 = Resistor: eVendorPart#: 71-CRCW0603-130-E3; Part#: CRCW0603130RFKEA; Manufacturer: Vishay/Dale; eVendor: Mouser; eVendorPrice: 0,06; MSRP: 0,015; MOQ: 1000
R321 R322 = Resistor: eVendorPart#: 71-CRCW0603-270-E3; Part#: CRCW0603270RFKEA; Manufacturer: Vishay/Dale; eVendor: Mouser; eVendorPrice: 0,06; MSRP: 0,015; MOQ: 1000
R323 R325-R327 = Resistor: as R206 on sheet blackfin_b_flash_jtag_serial; MOQ: 1000
R324 = Resistor: as R140 on sheet blackfin_a_sdram; MOQ: 1000
R328 = Resistor: as R147 on sheet blackfin_a_sdram; MOQ: 1000
TP301 TP302 TP304 = Test Point: as TP100 on sheet blackfin_a_sdram; eVendorPart#: NÃO SE APLICA; Part#: NÃO SE APLICA; Manufacturer: NÃO SE APLICA; MOQ: 1000; MSRP: 0,00
U1 = ADSP-BF518: as U1 on sheet blackfin_a_sdram; Part#: ADSP-BF518BSWZ-4; Manufacturer: Analog Devices; MOQ: 1000
U301 = DP83848C: Manufacturer: National Semiconductor; Part#: DP83848CVV/NOPB; eVendorPart#: DP83848CVV-ND; eVendor: Digikey; MSRP: 3,672; eVendorPrice: 6,8; MOQ: 1000
Y300 = Oscillator_25MHz: as Y100 on sheet blackfin_a_sdram; MOQ: 1000

## Sheet blackfin_d_codec.SchDoc: Audio CODEC
size A3; SheetNumber: 4; SheetTotal: 6
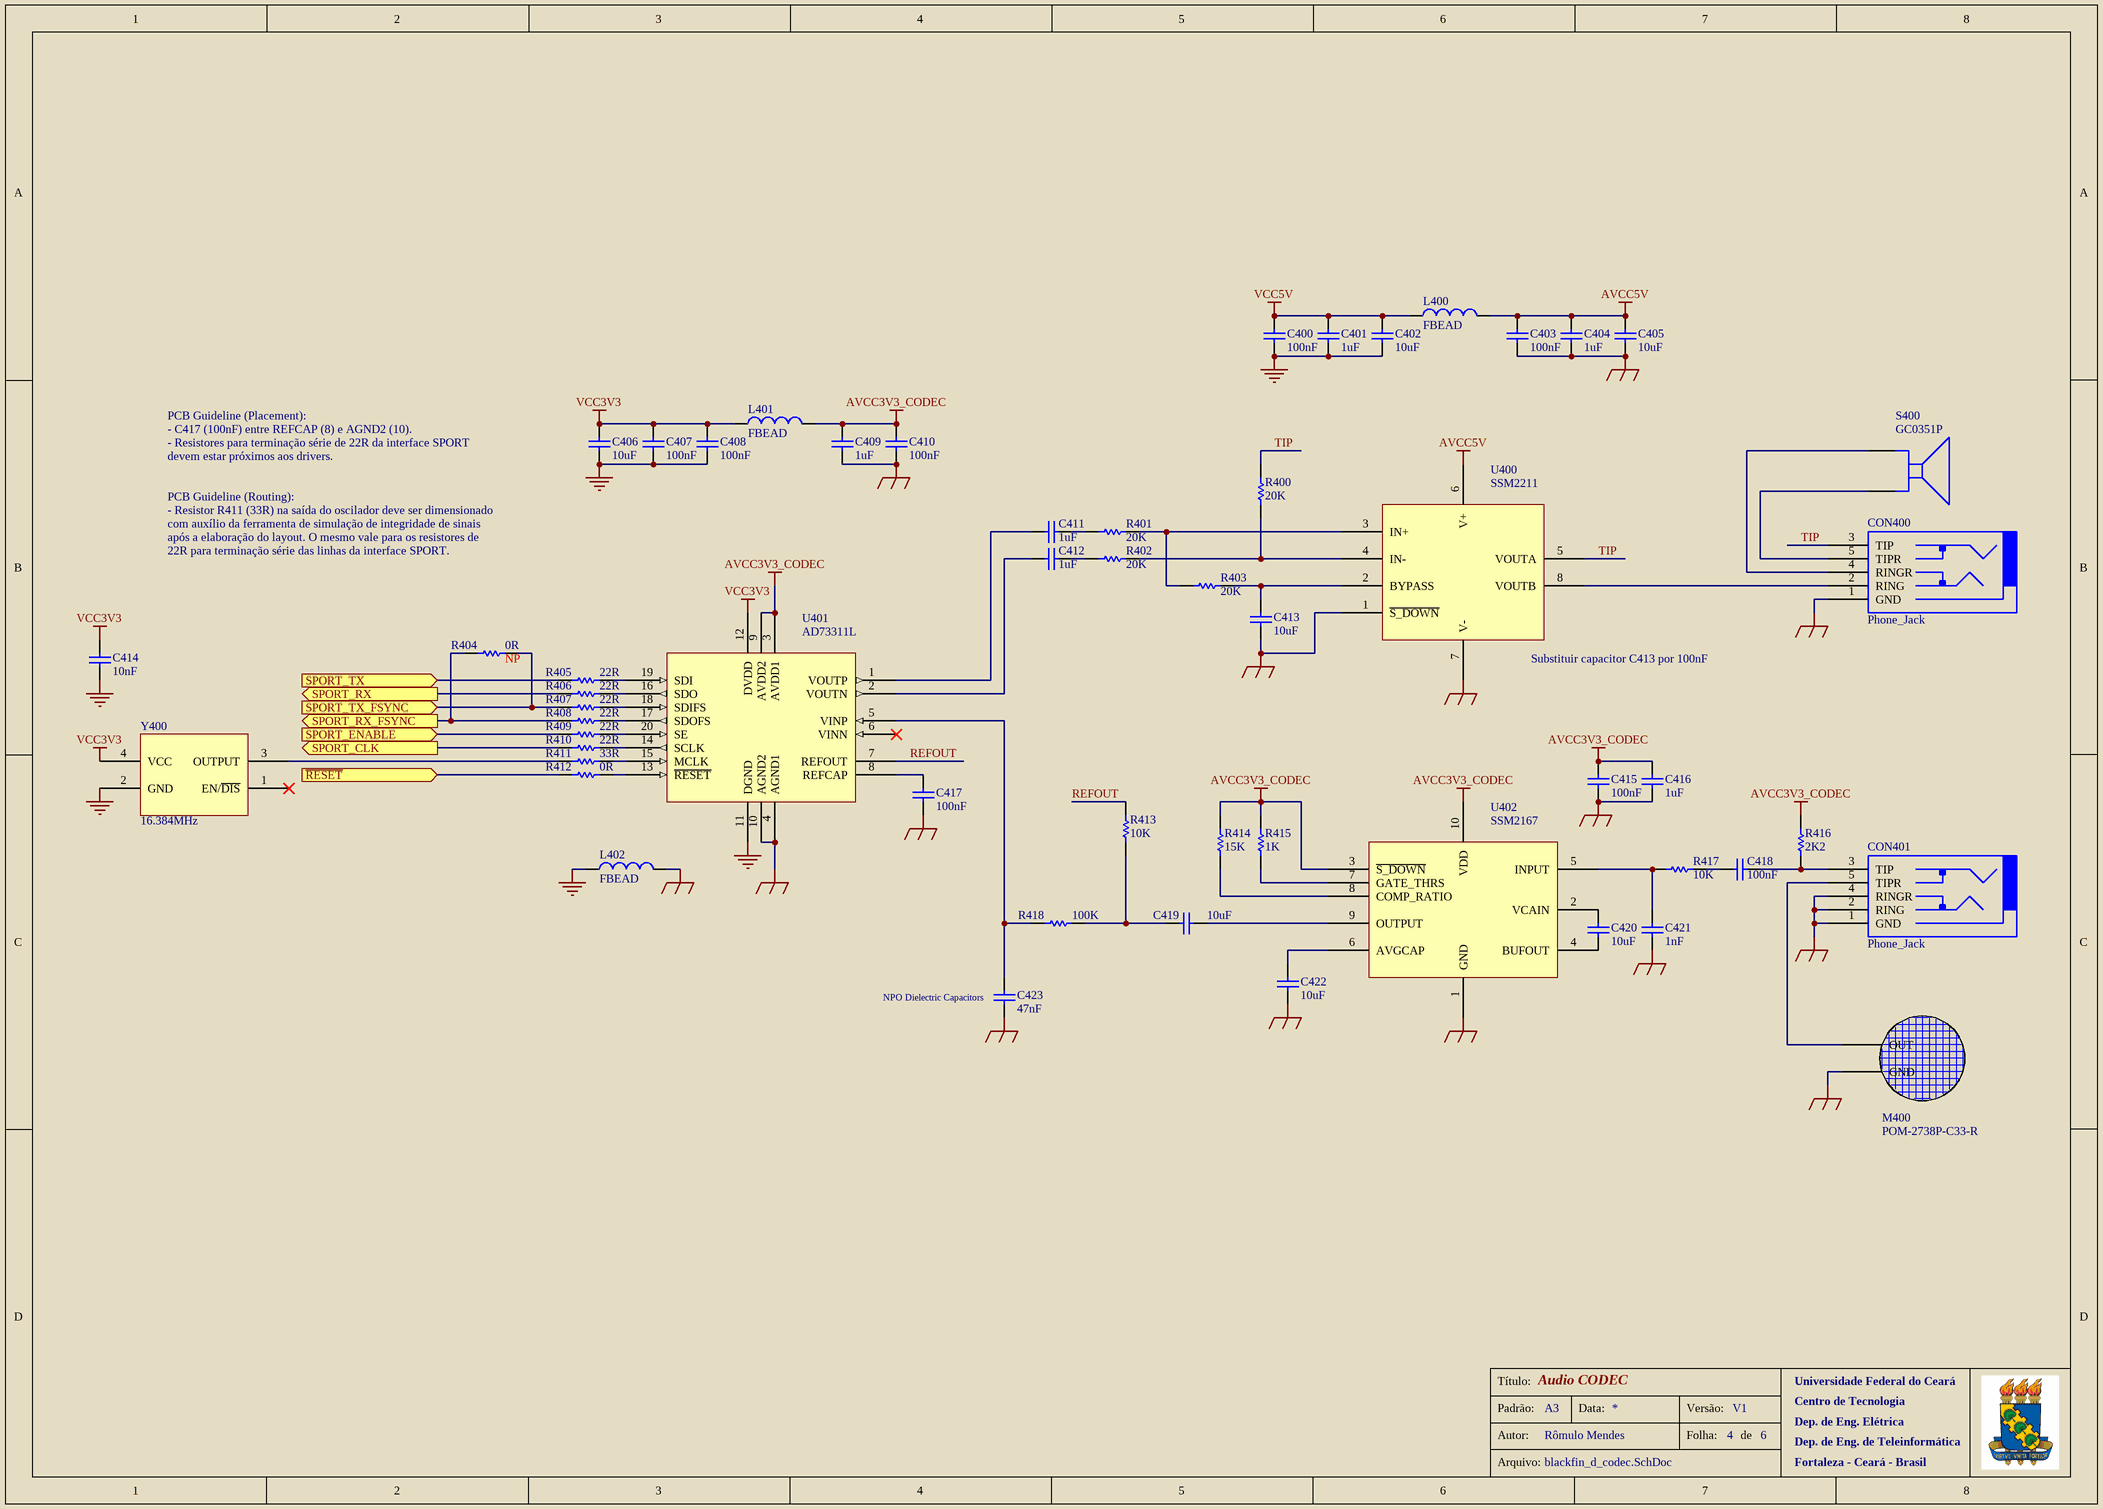
[diagram p3: blackfin_d_codec.SchDoc]

### Parts
C400  100nF  [C_0603]
C401  1uF  [C_0603]
C402  10uF  [C_0805]
C403  100nF  [C_0603]
C404  1uF  [C_0603]
C405  10uF  [C_0805]
C406  10uF  [C_0805]
C407  100nF  [C_0603]
C408  100nF  [C_0603]
C409  1uF  [C_0603]
C410  100nF  [C_0603]
C411  1uF  [C_0603]
C412  1uF  [C_0603]
C413  10uF  [C_0805]
C414  10nF  [C_0603]
C415  100nF  [C_0603]
C416  1uF  [C_0603]
C417  100nF  [C_0603]
C418  100nF  [C_0603]
C419  10uF  [C_0805]
C420  10uF  [C_0805]
C421  1nF  [C_0603]
C422  10uF  [C_0805]
C423  47nF  [C_0603]
CON400  Phone_Jack  [Phone_Jack]
CON401  Phone_Jack  [Phone_Jack]
L400  FBEAD  [L_0603]
L401  FBEAD  [L_0603]
L402  FBEAD  [L_0603]
M400  POM-2738P-C33-R  [Microphone]
R400  20K  [R_0603]
R401  20K  [R_0603]
R402  20K  [R_0603]
R403  20K  [R_0603]
R404  0R  [R_0603]
R405  22R  [R_0402]
R406  22R  [R_0402]
R407  22R  [R_0402]
R408  22R  [R_0402]
R409  22R  [R_0402]
R410  22R  [R_0402]
R411  33R  [R_0402]
R412  0R  [R_0603]
R413  10K  [R_0603]
R414  15K  [R_0603]
R415  1K  [R_0603]
R416  2K2  [R_0603]
R417  10K  [R_0603]
R418  100K  [R_0603]
S400  GC0351P  [Speaker]
U400  SSM2211  [SOIC-8 (SSM2211)]
U401  AD73311L  [TSSOP-20]
U402  SSM2167  [MSOP-10]
Y400  16.384MHz  [OSC_16.384MHz]

### Ports
SPORT_CLK (out), SPORT_ENABLE (in), SPORT_RX (out), SPORT_RX_FSYNC (out), SPORT_TX (in), SPORT_TX_FSYNC (in), ~{RESET} (in)

### Nets
AVCC3V3_CODEC: C409.2 C410.2 C415.2 C416.2 L401.2 R414.2 R415.2 R416.1 U401.3(AVDD1) U401.9(AVDD2) U402.3(~{S_DOWN}) U402.10(VDD)
AVCC5V: C403.2 C404.2 C405.2 L400.2 U400.6(V+)
EARTH: C403.1 C404.1 C405.1 C409.1 C410.1 C413.2 C415.1 C416.1 C417.1 C421.1 C422.2 C423.1 CON400.1(GND) CON401.1(GND) CON401.2(RING) CON401.4(RINGR) L402.2 M400.2(GND) U400.1(~{S_DOWN}) U400.7(V-) U401.4(AGND1) U401.10(AGND2) U402.1(GND)
GND: C400.1 C401.1 C402.1 C406.1 C407.1 C408.1 C414.1 L402.1 U401.11(DGND) Y400.2(GND)
VCC3V3: C406.2 C407.2 C408.2 C414.2 L401.1 U401.12(DVDD) Y400.4(VCC)
VCC5V: C400.2 C401.2 C402.2 L400.1
~{RESET}: R412.1 ; port ~{RESET}
REFOUT: R413.2 U401.7(REFOUT)
SPORT_CLK: R410.1 ; port SPORT_CLK
SPORT_ENABLE: R409.1 ; port SPORT_ENABLE
SPORT_RX: R406.1 ; port SPORT_RX
SPORT_RX_FSYNC: R404.1 R408.1 ; port SPORT_RX_FSYNC
SPORT_TX: R405.1 ; port SPORT_TX
SPORT_TX_FSYNC: R404.2 R407.1 ; port SPORT_TX_FSYNC
TIP: CON400.3(TIP) R400.2 U400.5(VOUTA)
NetC411_1: C411.1 R401.2
NetC411_2: C411.2 U401.1(VOUTP)
NetC412_1: C412.1 R402.2
NetC412_2: C412.2 U401.2(VOUTN)
NetC413_1: C413.1 R403.1 U400.2(BYPASS)
NetC417_2: C417.2 U401.8(REFCAP)
NetC418_1: C418.1 CON401.3(TIP) R416.2
NetC418_2: C418.2 R417.1
NetC419_1: C419.1 U402.9(OUTPUT)
NetC419_2: C419.2 R413.1 R418.1
NetC420_1: C420.1 U402.4(BUFOUT)
NetC420_2: C420.2 U402.2(VCAIN)
NetC421_2: C421.2 R417.2 U402.5(INPUT)
NetC422_1: C422.1 U402.6(AVGCAP)
NetC423_2: C423.2 R418.2 U401.5(VINP)
NetCON400_2: CON400.2(RING) U400.8(VOUTB)
NetCON400_4: CON400.4(RINGR) S400.1(CKT1)
NetCON400_5: CON400.5(TIPR) S400.2(CKT2)
NetCON401_5: CON401.5(TIPR) M400.1(OUT)
NetR400_1: R400.1 R402.1 U400.4(IN-)
NetR401_1: R401.1 R403.2 U400.3(IN+)
NetR405_2: R405.2 U401.19(SDI)
NetR406_2: R406.2 U401.16(SDO)
NetR407_2: R407.2 U401.18(SDIFS)
NetR408_2: R408.2 U401.17(SDOFS)
NetR409_2: R409.2 U401.20(SE)
NetR410_2: R410.2 U401.14(SCLK)
NetR411_1: R411.1 Y400.3(OUTPUT)
NetR411_2: R411.2 U401.15(MCLK)
NetR412_2: R412.2 U401.13(~{RESET})
NetR414_1: R414.1 U402.8(COMP_RATIO)
NetR415_1: R415.1 U402.7(GATE_THRS)

Not connected (* = marked no-connect by the designer): U401 6(VINN)*; Y400 1(EN/~{DIS})*

### Notes on the sheet
- PCB Guideline (Placement):
- - C417 (100nF) entre REFCAP (8) e AGND2 (10).
- - Resistores para terminação série de 22R da interface SPORT
- devem estar próximos aos drivers.
- PCB Guideline (Routing):
- - Resistor R411 (33R) na saída do oscilador deve ser dimensionado
- com auxílio da ferramenta de simulação de integridade de sinais
- após a elaboração do layout. O mesmo vale para os resistores de
- 22R para terminação série das linhas da interface SPORT.
- (near R404) NP
- (near U400) Substituir capacitor C413 por 100nF
- (near C423) NPO Dielectric Capacitors
- Título:
- Universidade Federal do Ceará
- Padrão:
- Autor:
- A3
- Rômulo Mendes
- Data:
- Versão:
- Folha:
- V1
- de
- Centro de Tecnologia
- Dep. de Eng. Elétrica
- Dep. de Eng. de Teleinformática
- Arquivo:
- Fortaleza - Ceará - Brasil

### Library data of the parts
C400 C403 C407 C408 C410 C415 C417 C418 = Capacitor: as C202 on sheet blackfin_b_flash_jtag_serial; MOQ: 1000
C401 C404 C409 C411 C412 C416 = Capacitor: as C201 on sheet blackfin_b_flash_jtag_serial; MOQ: 1000
C402 C405 C406 C413 C419 C420 C422 = Capacitor: as C204 on sheet blackfin_b_flash_jtag_serial; MOQ: 1000
C414 = Capacitor: as C100 on sheet blackfin_a_sdram; MOQ: 1000
C421 = Capacitor: eVendorPart#: 81-GRM1885C2A102JA01; Manufacturer: Murata; Part#: GRM1885C2A102JA01D; eVendor: Mouser; eVendorPrice: 0,08; MSRP: 0,019; MOQ: 1000
C423 = Capacitor: eVendorPart#: 81-GRM188R71H473KA61; Manufacturer: Murata; Part#: GRM188R71H473KA61D; eVendor: Mouser; eVendorPrice: 0,07; MSRP: 0,012; MOQ: 1000
CON400 CON401 = Phone_Jack: eVendorPart#: CP1-2535SJCT-ND; Manufacturer: CUI Inc; Part#: SJ1-2535-SMT; eVendorPrice: 0,75; eVendor: Digikey; MSRP: 0,415; MOQ: 1000
L400-L402 = Inductor: as L200 on sheet blackfin_b_flash_jtag_serial; MOQ: 1000
M400 = Microphone: eVendorPart#: 665-POM2738PC33R; Manufacturer: PUI Audio; MSRP: 1,13; eVendorPrice: 1,98; eVendor: Mouser; Part#: POM-2738P-C33-R; MOQ: 1000
R400-R403 = Resistor: eVendorPart#: 71-CRCW0603J-20K-E3; Part#: CRCW060320K0JNEA; Manufacturer: Vishay/Dale; eVendor: Mouser; eVendorPrice: 0,06; MSRP: 0,01; MOQ: 1000
R404 R412 = Resistor: as R206 on sheet blackfin_b_flash_jtag_serial; MOQ: 1000
R405-R410 = Resistor: as R100 on sheet blackfin_a_sdram; MOQ: 1000
R411 = Resistor: as R140 on sheet blackfin_a_sdram; MOQ: 1000
R413 R417 = Resistor: as R147 on sheet blackfin_a_sdram; MOQ: 1000
R414 = Resistor: eVendorPart#: 71-CRCW0603J-15K-E3; Part#: CRCW060315K0JNEA; Manufacturer: Vishay/Dale; eVendor: Mouser; eVendorPrice: 0,06; MSRP: 0,01; MOQ: 1000
R415 = Resistor: eVendorPart#: 71-CRCW06031K00JNEB; Part#: CRCW06031K00JNEB; Manufacturer: Vishay/Dale; eVendor: Mouser; eVendorPrice: 0,06; MSRP: 0,01; MOQ: 1000
R416 = Resistor: as R237 on sheet blackfin_b_flash_jtag_serial; MOQ: 1000
R418 = Resistor: as R144 on sheet blackfin_a_sdram; MOQ: 1000
S400 = Speaker: eVendorPart#: GC0351P-3-ND; Part#: GC0351P-3; Manufacturer: CUI Inc; eVendor: Digikey; eVendorPrice: 4,98; MSRP: 2,65267; MOQ: 1000
U400 = SSM2211: eVendorPart#: SSM2211SZ-ND; Part#: SSM2211SZ; Manufacturer: Analog Devices; eVendor: Digikey; eVendorPrice: 1,23; MSRP: 0,574; MOQ: 1000
U401 = AD73311L: eVendorPart#: AD73311LARUZ; Manufacturer: Analog Devices; eVendor: Avnet; MSRP: 3,41; eVendorPrice: 3,60; Part#: AD73311LARUZ; MOQ: 1000
U402 = SSM2167: eVendorPart#: SSM2167-1RMZ-REELCT-ND; Manufacturer: Analog Devices; Part#: SSM2167-1RMZ-REEL; eVendor: Digikey; eVendorPrice: 2,34; MSRP: 1,352; MOQ: 1000
Y400 = Oscillator_16.384MHz: eVendorPart#: 695-CSX750FBC-163; Part#: CSX750FBC-16.384M-UT; Manufacturer: Citizen; eVendor: Mouser; eVendorPrice: 2,98; MSRP: 1,20; MOQ: 1000

## Sheet blackfin_e_lcd_keypad.SchDoc: LCD, Keypad, Assembly
size A3; SheetNumber: 5; SheetTotal: 6
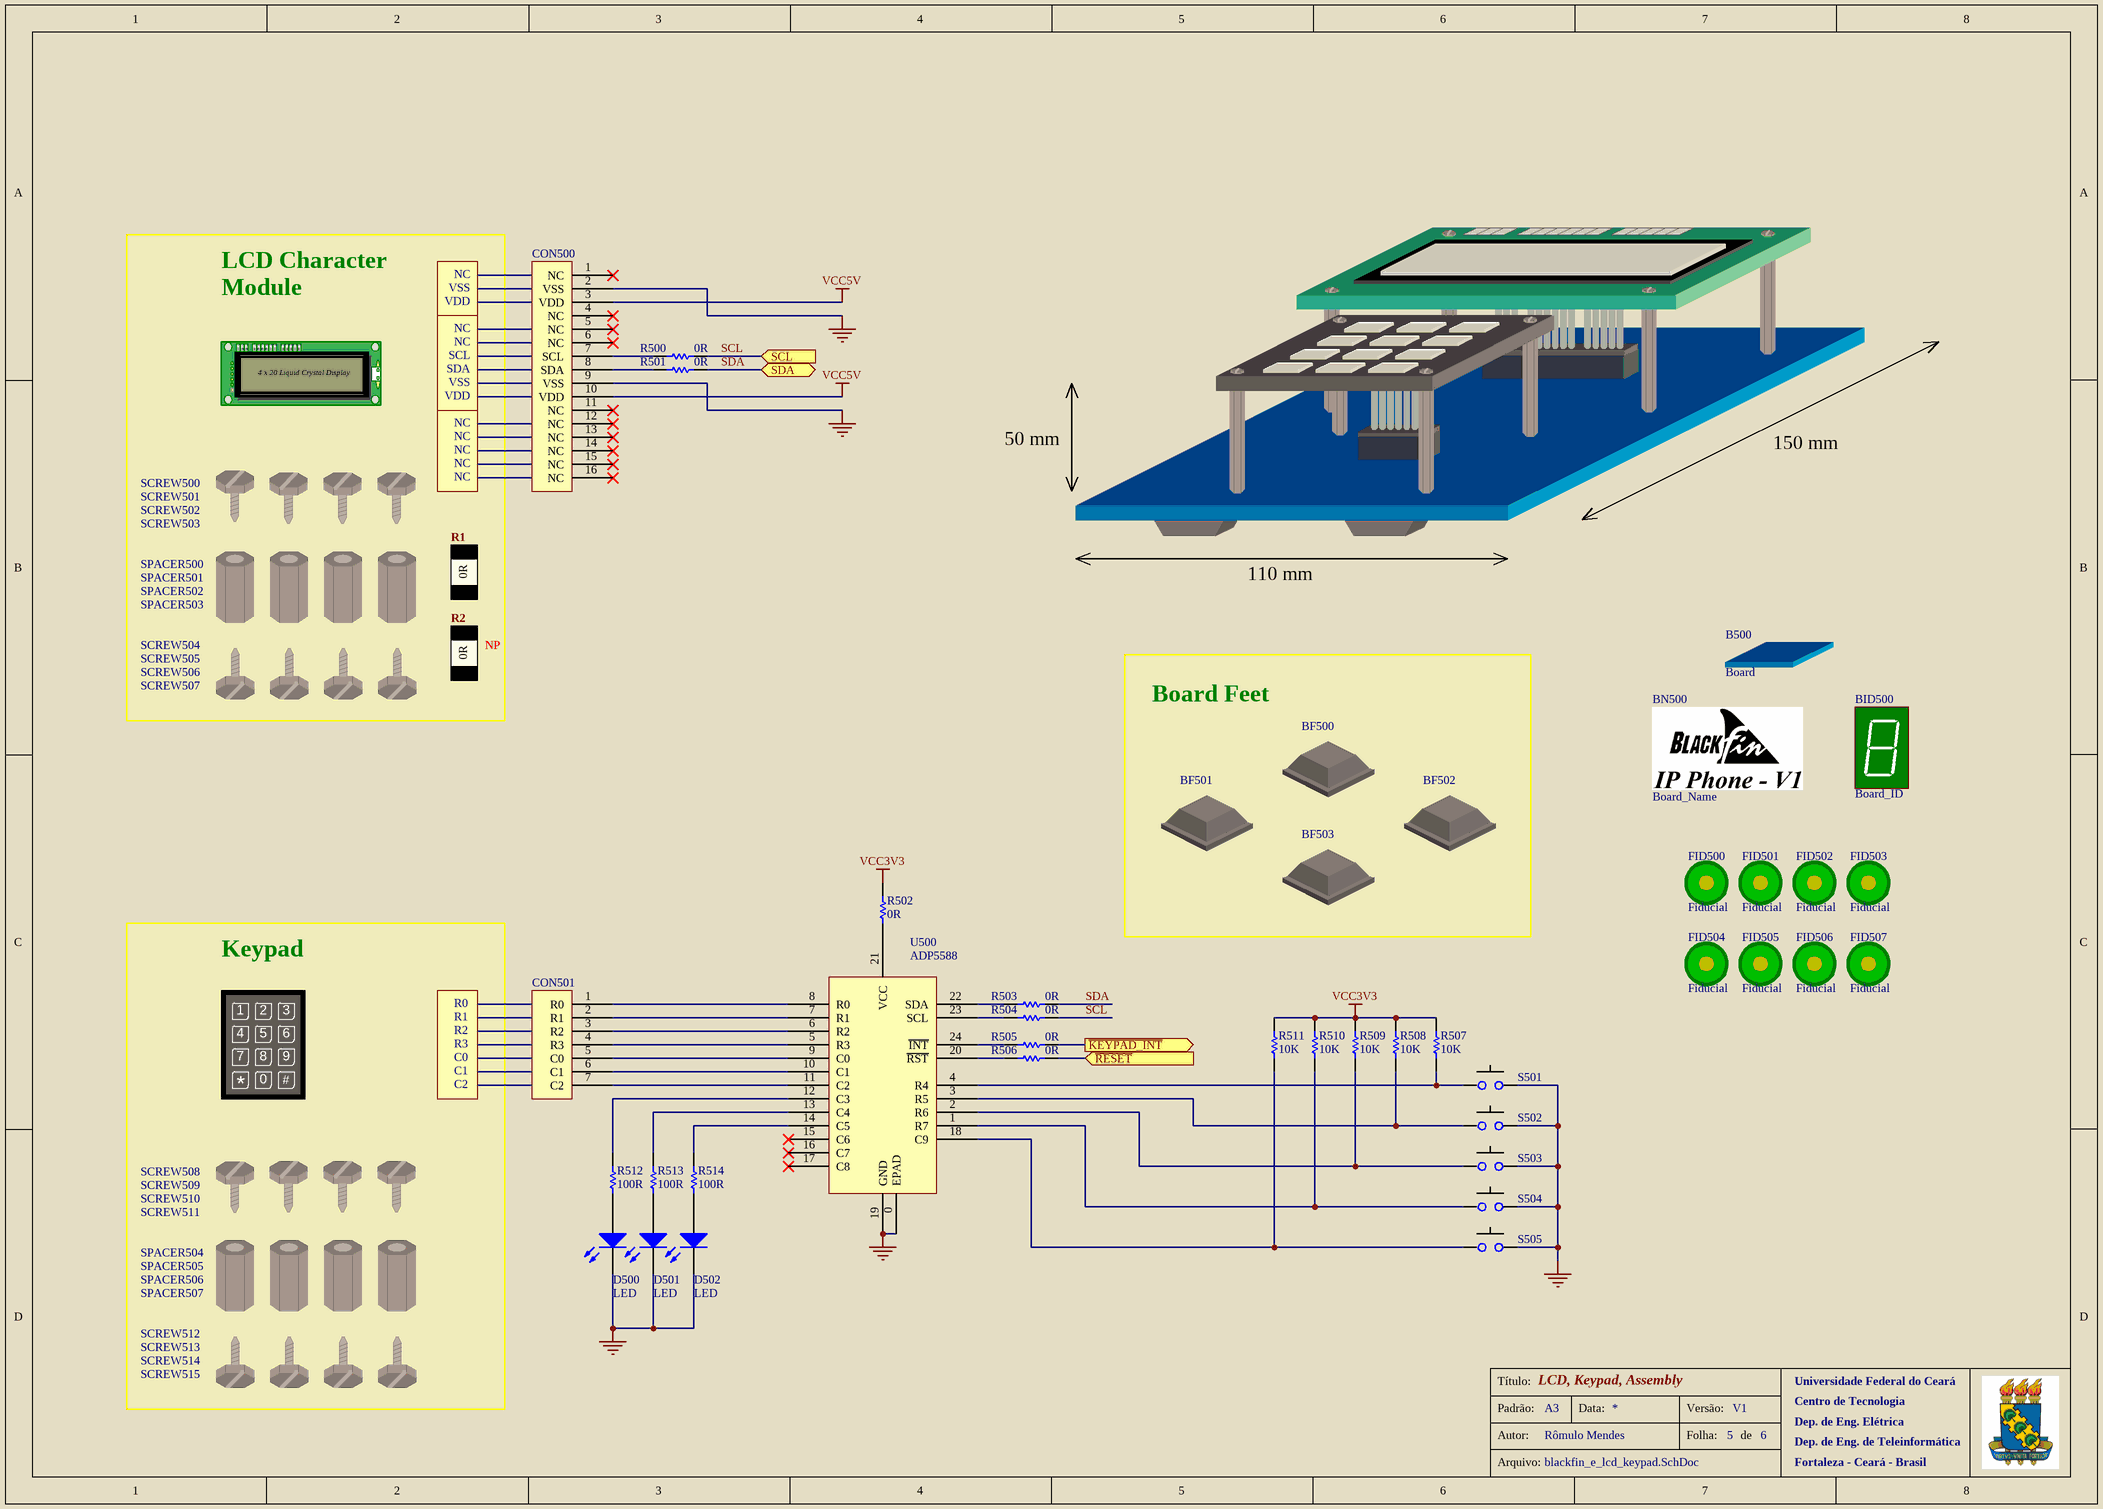
[diagram p4: blackfin_e_lcd_keypad.SchDoc]

### Parts
B500  Board  (mechanical)
BF500  Board Foot  [Board Foot (Hemisphere)]  (value not drawn)
BF501  Board Foot  [Board Foot (Hemisphere)]  (value not drawn)
BF502  Board Foot  [Board Foot (Hemisphere)]  (value not drawn)
BF503  Board Foot  [Board Foot (Hemisphere)]  (value not drawn)
BID500  Board_ID  [BOARD_ID]  (no BOM)
BN500  Board_Name  [LOGO]  (no BOM)
CON500  LCD_Connector  [SOCKET_1x16]  (value not drawn)
CON501  Keypad_Connector  [SOCKET_1x7]  (value not drawn)
D500  LED  [LED_0603]
D501  LED  [LED_0603]
D502  LED  [LED_0603]
FID500  Fiducial  [Fiducial]  (no BOM)
FID501  Fiducial  [Fiducial]  (no BOM)
FID502  Fiducial  [Fiducial]  (no BOM)
FID503  Fiducial  [Fiducial]  (no BOM)
FID504  Fiducial  [Fiducial]  (no BOM)
FID505  Fiducial  [Fiducial]  (no BOM)
FID506  Fiducial  [Fiducial]  (no BOM)
FID507  Fiducial  [Fiducial]  (no BOM)
KEYPAD_HEADER500  Keypad_Header_1x7  (value not drawn)  (mechanical)
LCD500  LCD  [LCD]  (value not drawn)
LCD_HEADER500  LCD_Header_1x3  (value not drawn)  (mechanical)
LCD_HEADER501  LCD_Header_1x6  (value not drawn)  (mechanical)
LCD_HEADER502  LCD_Header_1x5  (value not drawn)  (mechanical)
LCD_RES500  LCD_Resistor  (value not drawn)  (mechanical)
LCD_RES501  LCD_Resistor  (value not drawn)  (mechanical)
R500  0R  [R_0603]
R501  0R  [R_0603]
R502  0R  [R_0603]
R503  0R  [R_0603]
R504  0R  [R_0603]
R505  0R  [R_0603]
R506  0R  [R_0603]
R507  10K  [R_0603]
R508  10K  [R_0603]
R509  10K  [R_0603]
R510  10K  [R_0603]
R511  10K  [R_0603]
R512  100R  [R_0603]
R513  100R  [R_0603]
R514  100R  [R_0603]
S500  Keypad  [Keypad]  (value not drawn)
S501  Push Button  [Push Button]  (value not drawn)
S502  Push Button  [Push Button]  (value not drawn)
S503  Push Button  [Push Button]  (value not drawn)
S504  Push Button  [Push Button]  (value not drawn)
S505  Push Button  [Push Button]  (value not drawn)
SCREW500  Screw  (value not drawn)  (mechanical)
SCREW501  Screw  (value not drawn)  (mechanical)
SCREW502  Screw  (value not drawn)  (mechanical)
SCREW503  Screw  (value not drawn)  (mechanical)
SCREW504  Screw  (value not drawn)  (mechanical)
SCREW505  Screw  (value not drawn)  (mechanical)
SCREW506  Screw  (value not drawn)  (mechanical)
SCREW507  Screw  (value not drawn)  (mechanical)
SCREW508  Screw  (value not drawn)  (mechanical)
SCREW509  Screw  (value not drawn)  (mechanical)
SCREW510  Screw  (value not drawn)  (mechanical)
SCREW511  Screw  (value not drawn)  (mechanical)
SCREW512  Screw  (value not drawn)  (mechanical)
SCREW513  Screw  (value not drawn)  (mechanical)
SCREW514  Screw  (value not drawn)  (mechanical)
SCREW515  Screw  (value not drawn)  (mechanical)
SPACER500  Spacer  (value not drawn)  (mechanical)
SPACER501  Spacer  (value not drawn)  (mechanical)
SPACER502  Spacer  (value not drawn)  (mechanical)
SPACER503  Spacer  (value not drawn)  (mechanical)
SPACER504  Spacer  (value not drawn)  (mechanical)
SPACER505  Spacer  (value not drawn)  (mechanical)
SPACER506  Spacer  (value not drawn)  (mechanical)
SPACER507  Spacer  (value not drawn)  (mechanical)
U500  ADP5588  [QFN-24]

### Blocks framed on the sheet
Board Feet: BF500-BF503
Keypad: KEYPAD_HEADER500 S500 SCREW508-SCREW515 SPACER504-SPACER507

### Ports
SCL (in), SDA (bidir), ~{KEYPAD_INT} (out), ~{RESET} (in)

### Nets
GND: CON500.2(VSS) CON500.9(VSS) D500.2(K) D501.2(K) D502.2(K) S501.2 S502.2 S503.2 S504.2 S505.2 U500.0(EPAD) U500.19(GND)
VCC3V3: R502.2 R507.1 R508.1 R509.1 R510.1 R511.1
VCC5V: CON500.3(VDD) CON500.10(VDD)
~{KEYPAD_INT}: R505.2 ; port ~{KEYPAD_INT}
~{RESET}: R506.2 ; port ~{RESET}
SCL: R500.2 R504.2 ; port SCL
SDA: R501.2 R503.2 ; port SDA
NetCON500_7: CON500.7(SCL) R500.1
NetCON500_8: CON500.8(SDA) R501.1
NetCON501_1: CON501.1(R0) U500.8(R0)
NetCON501_2: CON501.2(R1) U500.7(R1)
NetCON501_3: CON501.3(R2) U500.6(R2)
NetCON501_4: CON501.4(R3) U500.5(R3)
NetCON501_5: CON501.5(C0) U500.9(C0)
NetCON501_6: CON501.6(C1) U500.10(C1)
NetCON501_7: CON501.7(C2) U500.11(C2)
NetD500_1: D500.1(A) R512.1
NetD501_1: D501.1(A) R513.1
NetD502_1: D502.1(A) R514.1
NetR502_1: R502.1 U500.21(VCC)
NetR503_1: R503.1 U500.22(SDA)
NetR504_1: R504.1 U500.23(SCL)
NetR505_1: R505.1 U500.24(~{INT})
NetR506_1: R506.1 U500.20(~{RST})
NetR507_2: R507.2 S501.1 U500.4(R4)
NetR508_2: R508.2 S502.1 U500.3(R5)
NetR509_2: R509.2 S503.1 U500.2(R6)
NetR510_2: R510.2 S504.1 U500.1(R7)
NetR511_2: R511.2 S505.1 U500.18(C9)
NetR512_2: R512.2 U500.12(C3)
NetR513_2: R513.2 U500.13(C4)
NetR514_2: R514.2 U500.14(C5)

Not connected (* = marked no-connect by the designer): CON500 1(NC)* 4(NC)* 5(NC)* 6(NC)* 11(NC)* 12(NC)* 13(NC)* 14(NC)* 15(NC)* 16(NC)*; U500 15(C6)* 16(C7)* 17(C8)*

### Notes on the sheet
- LCD Character
- (near LCD500) Module
- 50 mm
- 150 mm
- (near LCD_RES500) R1
- 110 mm
- (near LCD_RES501) R2
- (near LCD_RES501) NP
- Título:
- Universidade Federal do Ceará
- Padrão:
- Autor:
- A3
- Rômulo Mendes
- Data:
- Versão:
- Folha:
- V1
- de
- Centro de Tecnologia
- Dep. de Eng. Elétrica
- Dep. de Eng. de Teleinformática
- Arquivo:
- Fortaleza - Ceará - Brasil
- (in symbol Keypad) 1; 2; 3; 4; 5; 6; 7; 8; 9; 0; #
- (in symbol Keypad_Header_1x7) R0; R1; R2; R3; C0; C1; C2
- (in symbol LCD) 1; 2; 3; 5; 6; 7; 8; 9; 10; 12; 13; 14; 15; 16; 4 x 20 Liquid Crystal Display
- (in symbol LCD_Header_1x3) NC; VSS; VDD
- (in symbol LCD_Header_1x5) NC
- (in symbol LCD_Header_1x6) NC; SCL; SDA; VSS; VDD
- (in symbol LCD_Resistor) 0R

### Library data of the parts
B500 = Board: eVendor: NÃO SE APLICA; eVendorPrice: 0,00; eVendorPart#: NÃO SE APLICA; Part#: NÃO SE APLICA; MOQ: 1000; MSRP: 0,00; Manufacturer: NÃO SE APLICA
BF500-BF503 = Board Foot: eVendorPart#: 517-SJ-5003BK; Part#: SJ-5003 (BLACK); Manufacturer: 3M Electronic Specialty; eVendorPrice: 0,18; eVendor: Mouser; MSRP: 0,07; MOQ: 1000
BID500 = Board_ID: eVendor: NÃO SE APLICA; eVendorPrice: 0,00; eVendorPart#: NÃO SE APLICA; Part#: NÃO SE APLICA; Manufacturer: NÃO SE APLICA; MOQ: 1000; MSRP: 0,00
BN500 = Board_Name: eVendor: NÃO SE APLICA; eVendorPrice: 0,00; eVendorPart#: NÃO SE APLICA; Manufacturer: NÃO SE APLICA; MOQ: 1000; MSRP: 0,00; Part#: NÃO SE APLICA
CON500 = LCD_Connector: eVendorPart#: SSM-116-L-SV; Manufacturer: Samtec; eVendor: Techso; eVendorPrice: 1,55; MSRP: 1,29; MOQ: 1000; Part#: SSM-116-L-SV
CON501 = Keypad_Connector: eVendorPart#: SSM-107-L-SV; Manufacturer: Samtec; eVendor: Techso; eVendorPrice: 0,881; MSRP: 0,729; MOQ: 1000; Part#: SSM-107-L-SV
D500-D502 = LED: as D100 on sheet blackfin_a_sdram; MOQ: 1000
FID500-FID507 = Fiducial: eVendorPart#: NÃO SE APLICA; MSRP: 0,00; Manufacturer: NÃO SE APLICA; MOQ: 1000; Part#: NÃO SE APLICA; eVendor: NÃO SE APLICA; eVendorPrice: 0,00
KEYPAD_HEADER500 = Keypad_Header_1x7: eVendorPart#: ESQ-107-34-L-S; Manufacturer: Samtec; eVendor: Techso; eVendorPrice: 0,916; MSRP: 0,756; MOQ: 1000; Part#: ESQ-107-34-L-S
LCD500 = LCD: eVendorPart#: 763-0420D3Z-FL-GBW; Part#: NHD-0420D3Z-FL-GBW; Manufacturer: Newhaven; eVendor: Mouser; MSRP: 25,60; eVendorPrice: 31,75; MOQ: 1000
LCD_HEADER500 = LCD_Header_1x3: eVendorPart#: DW-03-12-F-S-694; Manufacturer: Samtec; eVendor: Techso; eVendorPrice: 0,173; MSRP: 0,144; MOQ: 1000; Part#: DW-03-12-F-S-694
LCD_HEADER501 = LCD_Header_1x6: eVendorPart#: DW-06-12-F-S-694; Manufacturer: Samtec; eVendor: Techso; eVendorPrice: 0,347; MSRP: 0,287; MOQ: 1000; Part#: DW-06-12-F-S-694
LCD_HEADER502 = LCD_Header_1x5: eVendorPart#: DW-05-12-F-S-694; Manufacturer: Samtec; eVendor: Techso; eVendorPrice: 0,289; MSRP: 0,239; MOQ: 1000; Part#: DW-05-12-F-S-694
LCD_RES500 LCD_RES501 = LCD_Resistor: eVendorPart#: 71-CRCW0805-0-E3; Manufacturer: Vishay/Dale; Part#: CRCW08050000Z0EA; eVendor: Mouser; eVendorPrice: 0,05; MSRP: 0,008; MOQ: 1000
R500-R506 = Resistor: as R206 on sheet blackfin_b_flash_jtag_serial; MOQ: 1000
R507-R511 = Resistor: as R147 on sheet blackfin_a_sdram; MOQ: 1000
R512-R514 = Resistor: as R149 on sheet blackfin_a_sdram; MOQ: 1000
S500 = Keypad: eVendorPart#: GH5009-ND; Part#: 96AB2-152-R; Manufacturer: Grayhill Inc; eVendor: Digikey; eVendorPrice: 12,26; MSRP: 6,6228; MOQ: 1000
S501-S505 = Push Button: as S100 on sheet blackfin_a_sdram; MOQ: 1000
SCREW500-SCREW515 = Screw: eVendorPart#: 534-29301; Part#: 29301; Manufacturer: Keystone Electronics; eVendor: Mouser; eVendorPrice: 0,28; MSRP: 0,14; MOQ: 1000
SPACER500-SPACER507 = Spacer: eVendorPart#: 534-24428; Manufacturer: Keystone Electronics; Part#: 24428; eVendor: Mouser; eVendorPrice: 0,60; MSRP: 0,30; MOQ: 1000
U500 = ADP5588: eVendorPart#: ADP5588ACPZ-R7CT-ND; Part#: ADP5588ACPZ-R7; Manufacturer: Analog Devices; eVendor: Digikey; MSRP: 1,56; eVendorPrice: 2,70; MOQ: 1000